# EasyEDA Pro project ProDoc_PCB1_2024-05-20.epro, board PCB1
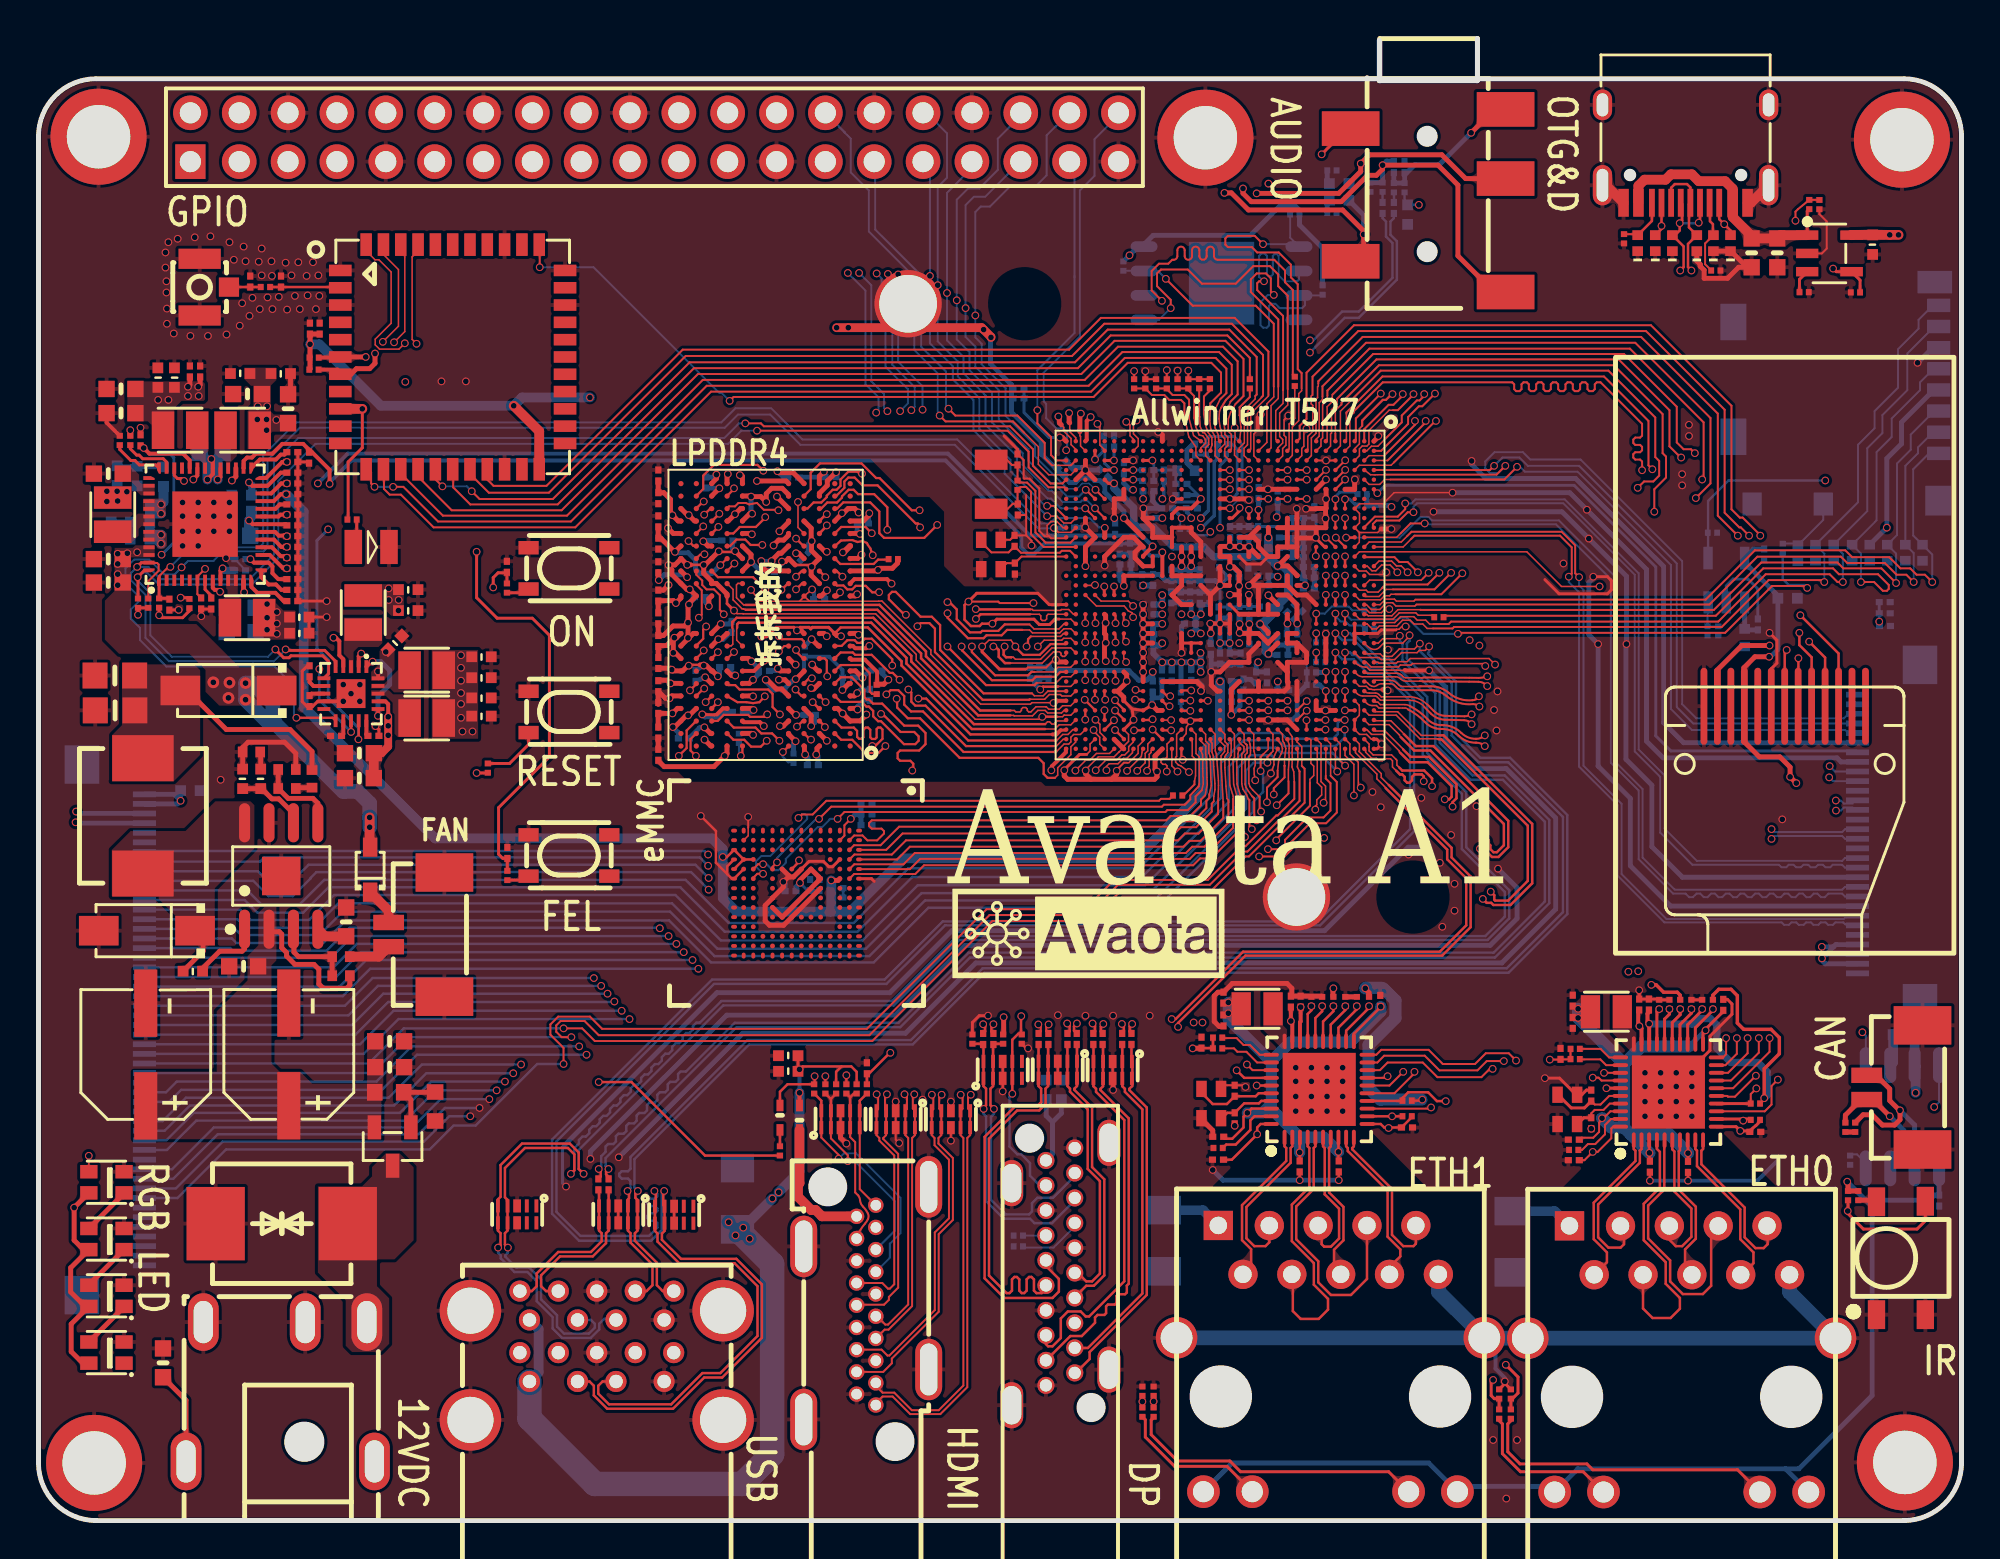
[diagram p0: board, top side]
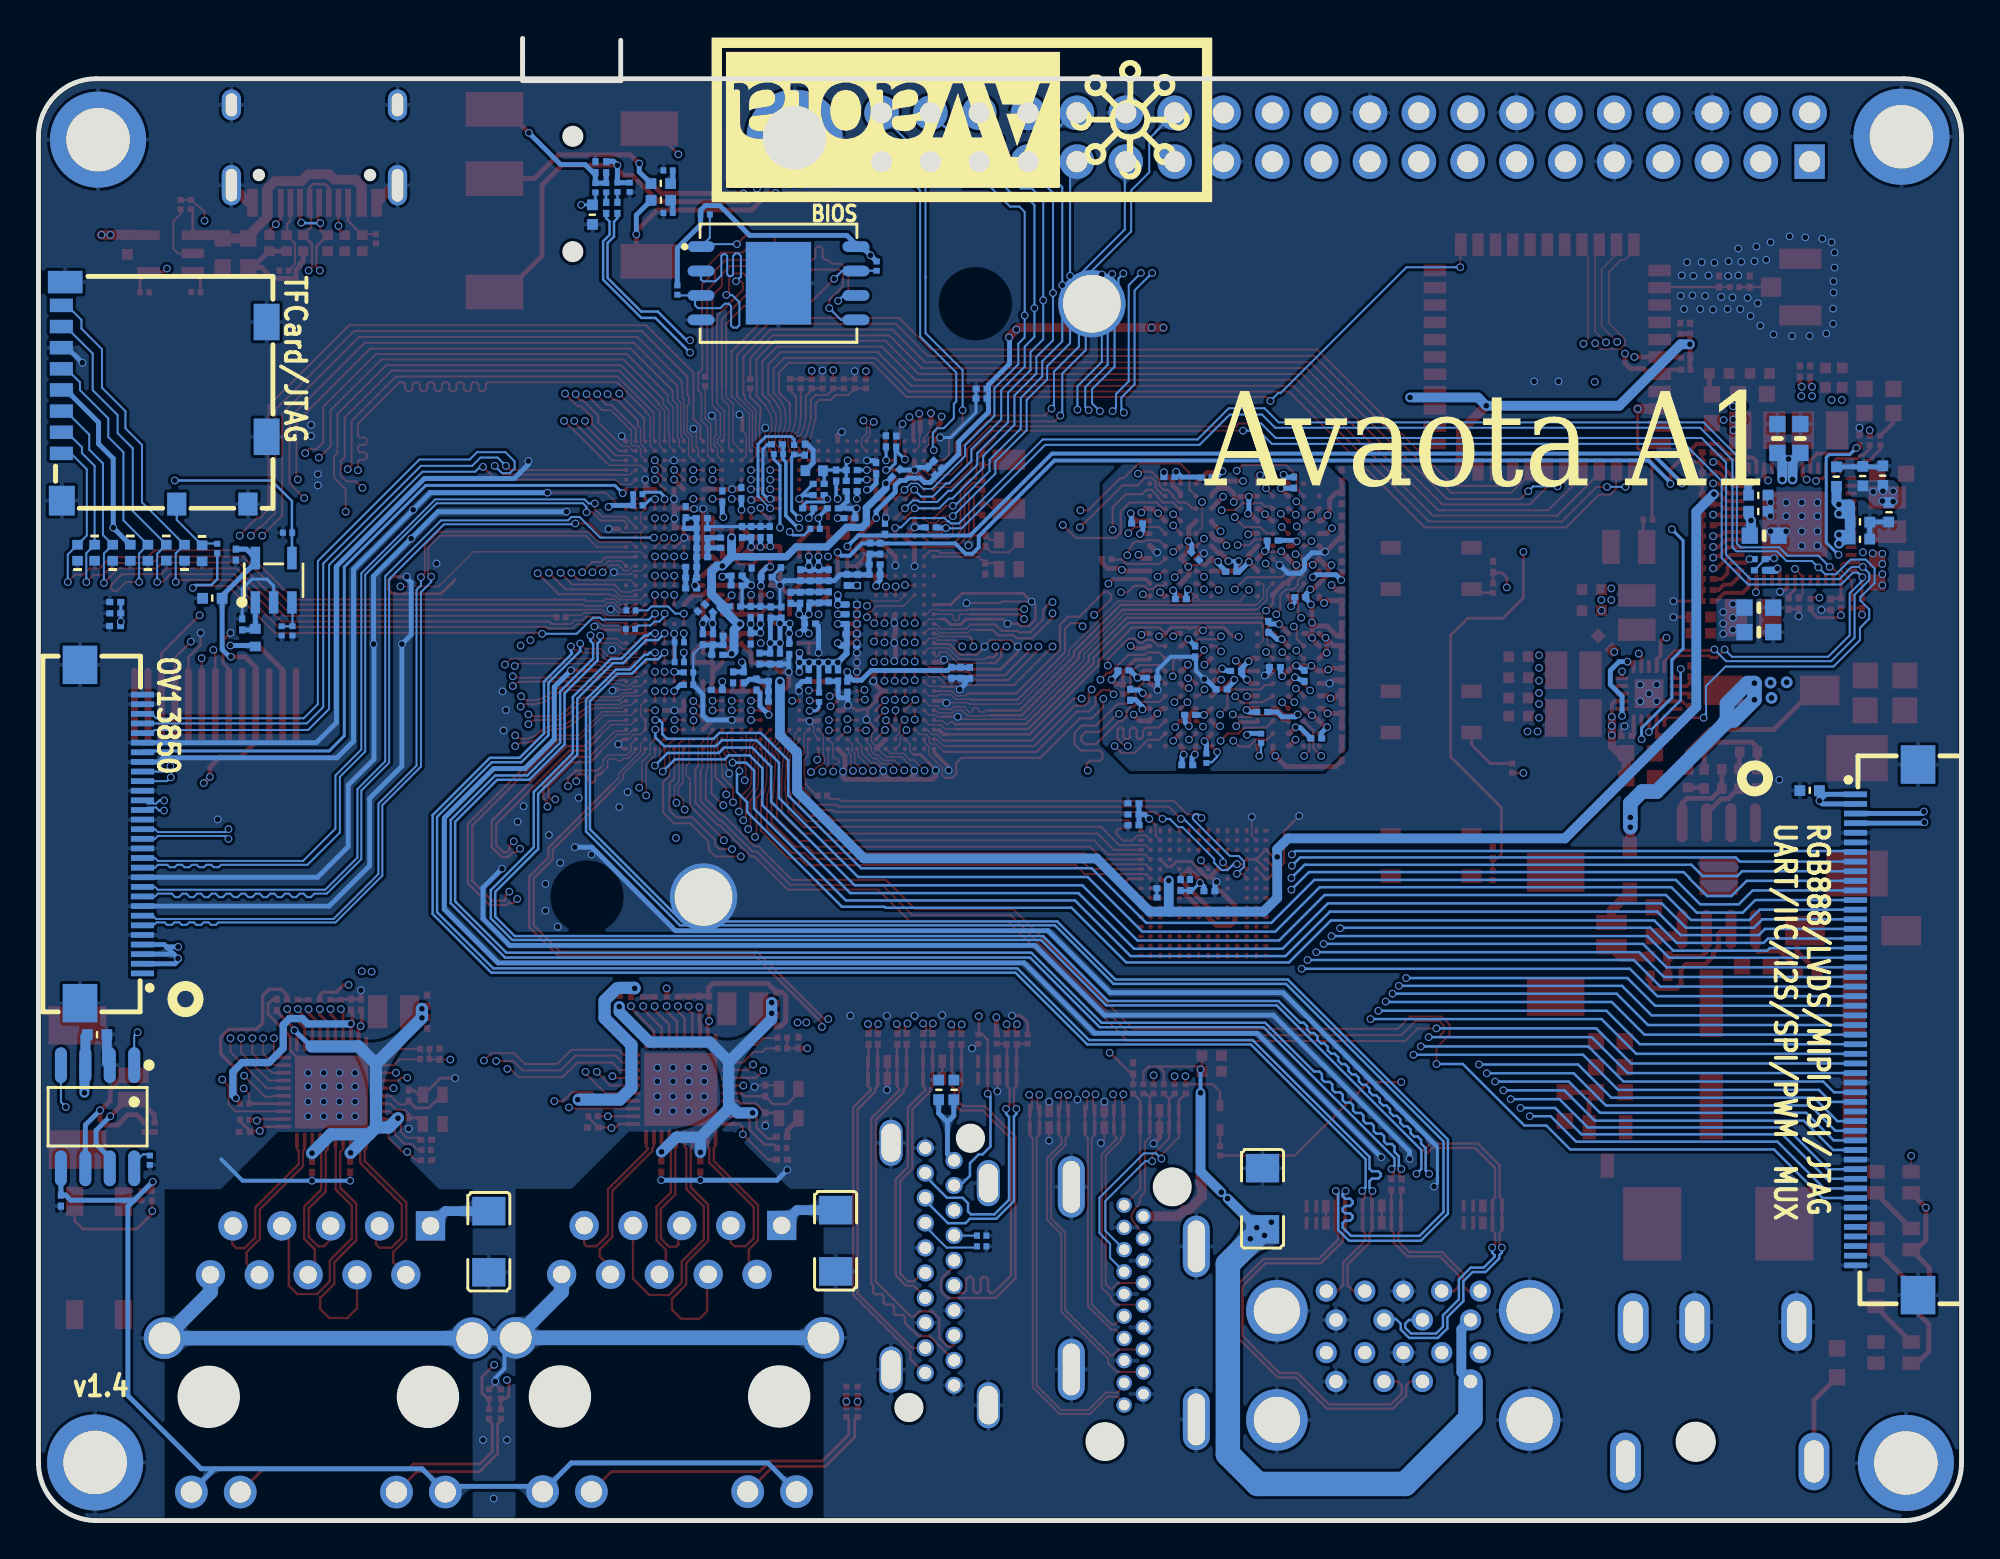
[diagram p1: board, bottom side, seen from below]

Outline 100 x 77.1 mm; copper layers: Top Layer, GND1, 内层2, VCC, 内层4, Inner5, GND2, Bottom Layer. Coordinates in mm from the lower left corner of the outline.
Outline path: 0,72 0,3 arc(0.88,0.88) 3,0 97,0 arc(99.12,0.88) 100,3 100,72 arc(99.12,74.12) 97,75 3,75 arc(0.88,74.12) 0,72
Stack: Top Layer 0.035mm 外层铜厚1oz / Dielectric1 0.1164mm 2116 RC54% 4.9mil / GND1 0.0152mm 内层铜厚 / Dielectric2 0.3mm 0.3mm H/HOZ 不含铜 / 内层2 0.0152mm 内层铜厚 / Dielectric3 0.0764mm 1080 RC67% 3.3mil / VCC 0.0152mm 内层铜厚 / Dielectric4 0.0764mm 1080 RC67% 3.3mil / 内层4 0.0152mm 内层铜厚 / Dielectric5 0.3mm 0.3mm H/HOZ 不含铜 / Inner5 0.0152mm 内层铜厚 / Dielectric6 0.0764mm 1080 RC67% 3.3mil / GND2 0.0152mm 内层铜厚 / Dielectric7 0.0764mm 1080 RC67% 3.3mil / Bottom Layer 0.035mm 外层铜厚1oz

## Design rules (mm)
net USB0-DP: DP31
net USB0-DM: DP31
net HTX0N: DP17
net HTXCN: DP18
net EDP-TX0P: DP24
net USB1-DM: DP8
net HTXCP: DP18
net HTX0P: DP17
net USB1-DP: DP8
net HTX2N: DP16
net HTX1N: DP15
net USB2-DM: DP5
net HTX1P: DP15
net HTX2P: DP16
net USB2-DP: DP5
net USB2-RXN: DP7
net USB2-RXP: DP7
net USB2-TXN: DP30
net USB2-TXP: DP30
net EDP-AUXN: DP28
net EDP-AUXP: DP28
net EDP-TX3N: DP25
net EDP-TX3P: DP25
net EDP-TX2N: DP26
net EDP-TX1N: DP27
net EDP-TX2P: DP26
net EDP-TX1P: DP27
net EDP-TX0N: DP24
net $6N5317: DP22
net $6N5519: DP21
net $6N5400: DP22
net $6N5561: DP21
net $6N5603: DP20
net $6N5687: DP19
net $6N5645: DP20
net $6N5729: DP19
net $6N6466: DP23
net $6N6451: DP23
net MICIN3P: DP29
net MICIN3N: DP29
net GM0_MDIP0: DP4
net GM0_MDIN0: DP4
net GM0_MDIP1: DP3
net GM0_MDIN1: DP3
net GM0_MDIP2: DP2
net GM0_MDIN2: DP2
net GM0_MDIP3: DP1
net GM0_MDIN3: DP1
net GM1_MDIP0: DP12
net GM1_MDIN0: DP12
net GM1_MDIP1: DP11
net GM1_MDIN1: DP11
net GM1_MDIP2: DP10
net GM1_MDIN2: DP10
net GM1_MDIP3: DP9
net GM1_MDIN3: DP9
net $6N19249: DP6
net $6N19248: DP6
net MCSI0-D0P: DP34
net MCSI0-D0N: DP34
net MCSI0-CKP: DP37
net MCSI0-D1P: DP35
net MCSI0-CKN: DP37
net MCSI0-D1N: DP35
net MCSI0-D2N: DP36
net MCSI0-D2P: DP36
net MCSI0-D3N: DP32
net MCSI0-D3P: DP32
template: 8L BGA
spacing safeClearance (default): track to track 0.076, other pairs 0.076 to 0.3
track width trackWidth (default): min 0.076, default 0.102, max 2.54
differential pair differentialPair (default): width min 0.076, default 0.254, max 2.54; gap min 0.076, default 0.102
via viaSize (default): diameter min 0.399, default 0.45, max 10; hole min 0.201, default 0.201, max 5.999
pour e6316 uses DRAMCopper
pour e6310 uses DRAMCopper
pour e6313 uses DRAMCopper
pour e6314 uses DRAMCopper
pour e6311 uses DRAMCopper
pour e19614 uses DRAMCopper
pour e16705 uses DRAMCopper
pour e26415 uses DRAMCopper
pour e258 uses DRAMCopper
pour e10559 uses DRAMCopper
pour e31695 uses DRAMCopper
pour e7555 uses TBCopper
pour e8913 uses TBCopper
pour e6312 uses DRAMCopper
pour e27896 uses TBCopper
pour e5680 uses TBCopper
pour e4340 uses TBCopper
pour e4860 uses TBCopper
pour e7035 uses TBCopper
pour e8075 uses TBCopper

## Placement (name value [footprint] x y rotation side)
C1  100nF  [C0603-NSK]  18.26 24.93 180 top
C2  100nF  [C0603-NSK]  18.26 23.59 180 top
C3  100nF  [C0603-NSK]  6.48 8.2 270 top
C4  100nF  [c0402-nsk]  8.03 28.58 180 top
C5  47uF  [C0805 NSK]  3.98 42.14 0 top
C6  47uF  [C0805 NSK]  3.97 43.96 0 top
C7  100nF  [C0603-NSK]  10.67 28.83 0 top
C8  100nF  [C0603-NSK]  16 31.14 270 top
C9  2200pF  [c0402-nsk]  11.56 38.58 90 top
C10  22pF  [c0402-nsk]  10.62 38.58 90 top
C11  100nF  [c0201 nsk]  8.46 47.7 270 top
C12  1uF  [c0201 nsk]  13.21 54.51 0 top
C13  2.2uF  [c0201 nsk]  56.23 50.55 270 bottom
C14  2.2uF  [c0201 nsk]  56.76 50.56 270 bottom
C15  22uF  [c0402-nsk]  13.56 46.16 180 top
C16  22uF  [c0402-nsk]  13.56 47 180 top
C17  1uF  [c0201 nsk]  13.21 51.77 0 top
C18  22uF  [c0402-nsk]  7.07 59.45 270 top
C19  2.2uF  [c0201 nsk]  61.37 47.24 90 bottom
C20  2.2uF  [c0201 nsk]  60.96 45.34 270 bottom
C21  2.2uF  [c0201 nsk]  62.51 44.83 270 bottom
C22  2.2uF  [c0201 nsk]  61.95 44.83 270 bottom
C23  2.2uF  [c0201 nsk]  61.44 44.83 270 bottom
C24  2.2uF  [c0201 nsk]  61.93 47.24 90 bottom
C25  22uF  [c0402-nsk]  6.21 59.45 270 top
C26  22uF  [c0402-nsk]  6.5 54.31 90 bottom
C27  22uF  [C0603-NSK]  3.63 48.79 0 top
C28  22uF  [C0603-NSK]  3.63 50.01 0 top
C29  22uF  [c0402-nsk]  5.28 51.94 180 bottom
C30  1uF  [c0201 nsk]  10.49 49.43 0 bottom
C31  22uF  [c0402-nsk]  12.6 59.66 180 top
C32  22uF  [c0402-nsk]  5.13 54.33 90 bottom
C33  22uF  [c0402-nsk]  10.49 59.66 0 top
C34  22uF  [c0402-nsk]  4.09 54.36 90 bottom
C35  2.2uF  [c0201 nsk]  14.07 55.3 90 top
C36  2.2uF  [c0201 nsk]  59.89 48.03 90 bottom
C37  2.2uF  [c0201 nsk]  59.4 48.03 90 bottom
C38  2.2uF  [c0201 nsk]  60.39 48.01 90 bottom
C39  2.2uF  [c0201 nsk]  60.89 48.01 90 bottom
C40  2.2uF  [c0201 nsk]  58.9 48.03 90 bottom
C41  2.2uF  [c0201 nsk]  59.87 46.66 180 bottom
C42  22uF  [c0402-nsk]  3.78 52.45 270 bottom
C43  1uF  [c0201 nsk]  8.99 47.69 270 top
C44  22uF  [C0603-NSK]  3.63 54.46 0 top
C45  2.2uF  [c0201 nsk]  5.31 56.19 270 top
C46  2.2uF  [c0201 nsk]  10.49 50.01 180 bottom
C47  2.2uF  [c0201 nsk]  62.13 49.07 180 bottom
C48  2.2uF  [c0201 nsk]  62.97 45.87 270 bottom
C49  2.2uF  [c0201 nsk]  62.97 47.27 90 bottom
C50  2.2uF  [c0201 nsk]  62.46 47.27 90 bottom
C51  2.2uF  [c0201 nsk]  13.21 47.83 0 top
C52  2.2uF  [c0201 nsk]  13.21 48.41 0 top
C53  2.2uF  [c0201 nsk]  13.21 49.53 0 top
C54  2.2uF  [c0201 nsk]  13.21 50.09 0 top
C55  2.2uF  [c0201 nsk]  13.21 48.97 0 top
C56  2.2uF  [c0402-nsk]  10.57 53.34 0 bottom
C57  2.2uF  [c0201 nsk]  66.07 49.05 0 bottom
C58  2.2uF  [c0201 nsk]  66.07 48.49 0 bottom
C59  2.2uF  [c0201 nsk]  13.21 50.65 0 top
C60  2.2uF  [c0201 nsk]  13.2 53.39 180 top
C61  2.2uF  [c0201 nsk]  13.21 51.21 0 top
C62  2.2uF  [c0201 nsk]  13.2 53.95 180 top
C63  2.2uF  [c0201 nsk]  13.21 52.32 0 top
C64  2.2uF  [c0201 nsk]  13.2 55.07 180 top
C65  2.2uF  [c0201 nsk]  13.21 52.86 0 top
C66  2.2uF  [c0201 nsk]  13.2 55.58 180 top
C67  2.2uF  [c0201 nsk]  66.07 49.61 0 bottom
C68  2.2uF  [c0201 nsk]  65.48 50.11 180 bottom
C69  2.2uF  [c0201 nsk]  17.42 40.82 0 top
C70  4.7uF  [c0402-nsk]  18.54 45.66 225 top
C71  2.2uF  [c0201 nsk]  15.47 40.82 180 top
C72  22uF  [c0402-nsk]  23.04 41.84 180 top
C73  2.2uF  [c0201 nsk]  14.1 44.18 90 top
C74  22uF  [c0402-nsk]  23.04 42.79 180 top
C75  2.2uF  [c0201 nsk]  63.42 51.43 90 bottom
C76  2.2uF  [c0201 nsk]  62.94 51.43 90 bottom
C77  2.2uF  [c0201 nsk]  61.97 51.43 90 bottom
C78  2.2uF  [c0201 nsk]  62.45 51.43 90 bottom
C79  4.7uF  [c0402-nsk]  5.28 51.05 0 bottom
C80  22uF  [c0402-nsk]  23.04 43.84 180 top
C81  22uF  [c0402-nsk]  23.04 44.93 180 top
C82  4.7uF  [c0402-nsk]  10.57 52.5 0 bottom
C83  2.2uF  [c0201 nsk]  59.39 49.17 270 bottom
C84  2.2uF  [c0201 nsk]  58.91 49.17 270 bottom
C85  2.2uF  [c0201 nsk]  59.87 49.17 270 bottom
C86  2.2uF  [c0201 nsk]  60.38 49.17 270 bottom
C87  22uF  [c0402-nsk]  19.23 47.34 180 top
C88  1uF  [c0201 nsk]  14.1 42.62 270 top
C89  22uF  [c0402-nsk]  19.23 48.42 180 top
C90  100nF  [c0201 nsk]  56.51 49.73 180 bottom
C91  100nF  [c0201 nsk]  62.66 43.49 270 bottom
C92  100nF  [c0201 nsk]  55.98 51.59 270 bottom
C93  100nF  [c0201 nsk]  56.51 49.2 180 bottom
C94  1nF  [c0201 nsk]  53.59 51.66 180 bottom
C95  1nF  [c0201 nsk]  6.81 47.65 90 top
C96  1nF  [c0201 nsk]  24.38 34.72 270 top
C97  1nF  [c0201 nsk]  24.36 49.61 270 top
C98  22pF  [c0201 nsk]  50.77 49.52 90 top
C99  22pF  [c0201 nsk]  50.76 50.96 270 top
C100  22pF  [c0201 nsk]  50.93 52.6 90 top
C101  22pF  [c0201 nsk]  50.91 55.19 270 top
C102  100nF  [c0201 nsk]  57.84 52.15 0 bottom
C103  2.2uF  [c0201 nsk]  57.71 53.54 180 bottom
C104  2.2uF  [c0201 nsk]  64.24 50.6 180 bottom
C105  2.2uF  [c0201 nsk]  55.93 56.13 270 bottom
C106  10nF  [c0201 nsk]  60.15 55.7 270 bottom
C107  1nF  [c0201 nsk]  61.59 55.98 180 bottom
C108  2.2uF  [c0201 nsk]  59.44 53.92 0 bottom
C109  470nF  [c0201 nsk]  57.7 54.08 180 bottom
C110  470nF  [c0201 nsk]  57.7 54.64 180 bottom
C111  470nF  [c0201 nsk]  58.52 54.36 270 bottom
C112  470nF  [c0201 nsk]  59.97 52.65 180 bottom
C113  2.2uF  [c0201 nsk]  58.7 52.65 0 bottom
C114  2.2uF  [c0201 nsk]  59.44 53.34 0 bottom
C115  2.2uF  [c0201 nsk]  55.4 56.12 270 bottom
C116  2.2uF  [c0201 nsk]  33.55 40.69 180 bottom
C117  2.2uF  [c0201 nsk]  34.16 43.94 90 bottom
C118  100nF  [c0201 nsk]  40.11 41.91 180 bottom
C119  100nF  [c0201 nsk]  58.93 43.97 90 bottom
C120  100nF  [c0201 nsk]  37.97 49.35 180 bottom
C121  100nF  [c0201 nsk]  40.6 47.93 0 bottom
C122  100nF  [c0201 nsk]  43.59 44.22 0 bottom
C123  100nF  [c0201 nsk]  43.23 42.95 270 bottom
C124  100nF  [c0201 nsk]  36.37 42.06 0 bottom
C125  100nF  [c0201 nsk]  41.2 54.28 0 bottom
C126  100nF  [c0201 nsk]  57.75 45.52 0 bottom
C127  100nF  [c0201 nsk]  57.73 46.1 0 bottom
C128  100nF  [c0201 nsk]  57.73 47.65 0 bottom
C129  100nF  [c0201 nsk]  59.94 43.99 90 bottom
C130  100nF  [c0201 nsk]  35.81 50.98 180 bottom
C131  100nF  [c0201 nsk]  32.23 41 90 top
C132  2.2uF  [c0201 nsk]  52.53 44.09 270 bottom
C133  100nF  [c0201 nsk]  57.94 43.38 90 bottom
C134  2.2uF  [c0201 nsk]  39.85 45.21 90 bottom
C135  100nF  [c0201 nsk]  38.48 43.23 0 bottom
C136  100nF  [c0201 nsk]  32.23 50.83 90 top
C137  100nF  [c0201 nsk]  35.71 44.4 0 bottom
C138  100nF  [c0201 nsk]  42.09 43.84 180 bottom
C139  100nF  [c0201 nsk]  32.23 51.97 270 top
C140  100nF  [c0201 nsk]  32.23 43.41 90 top
C141  100nF  [c0201 nsk]  39.85 50.17 225 bottom
C142  2.2uF  [c0201 nsk]  36.04 46.48 270 bottom
C143  2.2uF  [c0201 nsk]  34.72 54 90 bottom
C144  100nF  [c0201 nsk]  39.24 54.25 180 bottom
C145  100nF  [c0201 nsk]  42.88 51.87 0 bottom
C146  100nF  [c0201 nsk]  32.23 42.27 270 top
C147  2.2uF  [c0201 nsk]  32.23 44.6 270 top
C148  100nF  [c0201 nsk]  32.23 45.75 270 top
C149  100nF  [c0201 nsk]  32.23 46.94 90 top
C150  100nF  [c0201 nsk]  32.23 49.58 270 top
C151  100nF  [c0201 nsk]  37.72 44.2 180 bottom
C152  100nF  [c0201 nsk]  40.26 39.29 180 bottom
C153  100nF  [c0201 nsk]  57.73 46.63 0 bottom
C154  100nF  [c0201 nsk]  57.73 47.14 0 bottom
C155  100nF  [c0201 nsk]  58.42 43.97 90 bottom
C156  100nF  [c0201 nsk]  34.39 48.03 0 bottom
C157  100nF  [c0201 nsk]  32.23 39.83 270 top
C158  100nF  [c0201 nsk]  32.23 48.11 270 top
C159  100nF  [c0201 nsk]  32.23 53.19 90 top
C160  100nF  [c0201 nsk]  32.23 54.36 270 top
C161  2.2uF  [c0201 nsk]  52.04 44.09 270 bottom
C162  100nF  [c0201 nsk]  51.56 44.09 90 bottom
C163  2.2uF  [c0201 nsk]  61.75 43.13 180 bottom
C164  100nF  [c0201 nsk]  61.75 43.66 180 bottom
C165  2.2uF  [c0201 nsk]  63.45 53.44 270 bottom
C166  100nF  [c0201 nsk]  63.32 43.87 90 bottom
C167  2.2uF  [c0201 nsk]  65.13 47.45 225 bottom
C168  100nF  [c0201 nsk]  65.51 47.09 225 bottom
C169  2.2uF  [c0201 nsk]  64.72 43.21 180 bottom
C170  100nF  [c0201 nsk]  64.44 53.26 270 bottom
C171  2.2uF  [c0201 nsk]  63.88 43.87 90 bottom
C172  100nF  [c0201 nsk]  56.44 54.74 270 bottom
C173  2.2uF  [c0201 nsk]  63.7 49.15 0 bottom
C174  100nF  [c0201 nsk]  63.7 48.64 0 bottom
C175  2.2uF  [c0201 nsk]  64.92 45.85 90 bottom
C176  100nF  [c0201 nsk]  65.46 45.85 90 bottom
C177  2.2uF  [c0201 nsk]  57.96 48.92 270 bottom
C178  100nF  [c0201 nsk]  57.39 48.91 270 bottom
C179  2.2uF  [c0201 nsk]  14.62 62 270 top
C180  100nF  [c0201 nsk]  14.12 62 270 top
C181  2.2uF  [c0201 nsk]  53.22 54.92 225 bottom
C182  100nF  [c0201 nsk]  53.56 54.57 225 bottom
C183  2.2uF  [c0201 nsk]  50.96 58.37 180 bottom
C184  100nF  [c0201 nsk]  50.95 58.88 180 bottom
C185  2.2uF  [c0201 nsk]  64.11 45.54 180 bottom
C186  100nF  [c0201 nsk]  64.11 46.03 180 bottom
C187  2.2uF  [c0201 nsk]  63.78 47.55 0 bottom
C188  100nF  [c0201 nsk]  64.24 51.13 180 bottom
C189  100nF  [c0201 nsk]  43.08 23.52 270 top
C190  100nF  [c0201 nsk]  56.84 25.05 270 top
C191  100nF  [c0201 nsk]  56.35 25.05 270 top
C192  100nF  [c0201 nsk]  55.34 25.05 270 top
C193  100nF  [c0201 nsk]  54.85 25.05 270 top
C194  100nF  [c0201 nsk]  53.99 25.05 270 top
C195  100nF  [c0201 nsk]  53.51 25.05 270 top
C196  100nF  [c0201 nsk]  52.52 25.05 270 top
C197  100nF  [c0201 nsk]  52.01 25.05 270 top
C198  100nF  [c0201 nsk]  49.12 25.04 270 top
C199  100nF  [c0201 nsk]  49.66 25.04 270 top
C200  10uF  [c0402-nsk]  90.96 47.97 180 bottom
C201  2.2uF  [c0201 nsk]  64.69 45.03 180 bottom
C202  2.2uF  [c0201 nsk]  55.42 54.48 315 bottom
C204  2.2uF  [c0201 nsk]  98.83 16.65 90 bottom
C208  2.2uF  [c0201 nsk]  61.39 49.86 90 bottom
C209  100nF  [c0201 nsk]  62.92 49.84 90 bottom
C210  2.2uF  [c0201 nsk]  7.87 59.77 270 top
C211  100nF  [c0201 nsk]  65.51 51.61 0 bottom
C213  100nF  [c0201 nsk]  65.51 52.15 0 bottom
C214  2.2uF  [c0201 nsk]  66.34 52.45 270 bottom
C215  2.2uF  [c0201 nsk]  65.49 50.6 0 bottom
C216  100nF  [c0201 nsk]  65.49 51.11 0 bottom
C218  100nF  [c0201 nsk]  8.41 59.77 270 top
C219  100nF  [c0201 nsk]  29.65 17.48 270 top
C220  100nF  [c0201 nsk]  29.11 17.48 270 top
C221  2.2uF  [c0402-nsk]  38.99 24.18 0 top
C222  100nF  [c0402-nsk]  38.99 23.37 0 top
C223  2.2uF  [c0402-nsk]  53.19 22.41 270 bottom
C224  100nF  [c0402-nsk]  52.4 22.41 270 bottom
C225  2.2uF  [c0201 nsk]  41.55 32.41 0 bottom
C226  100nF  [c0201 nsk]  41.55 32.89 180 bottom
C227  100nF  [c0201 nsk]  61.75 42.6 180 bottom
C228  2.2uF  [c0201 nsk]  96.01 47.19 0 bottom
C229  100nF  [c0201 nsk]  40.13 33.05 270 bottom
C230  100nF  [c0201 nsk]  39.12 32.74 0 bottom
C231  2.2uF  [c0201 nsk]  43.07 37.31 0 bottom
C232  100nF  [c0201 nsk]  43.05 36.73 180 bottom
C233  100nF  [c0201 nsk]  43.05 36.17 180 bottom
C234  2.2uF  [c0201 nsk]  96.01 47.78 0 bottom
C235  100nF  [c0201 nsk]  40.61 33.05 270 bottom
C236  100nF  [c0201 nsk]  96.01 46.53 180 bottom
C237  2.2uF  [c0402-nsk]  71.19 67.93 90 bottom
C238  100nF  [c0201 nsk]  70.48 68.29 90 bottom
C239  33pF  [c0201 nsk]  70.48 70.4 270 bottom
C240  100nF  [c0201 nsk]  71.04 70.4 270 bottom
C241  100nF  [c0201 nsk]  69.89 68.29 90 bottom
C242  100nF  [c0402-nsk]  67.63 68.68 180 bottom
C243  100nF  [c0402-nsk]  67.64 69.55 180 bottom
C244  NC  [c0201 nsk]  12.61 64.45 270 top
C245  NC  [c0201 nsk]  11.01 64.45 270 top
C246  100nF  [c0402-nsk]  96.95 25.28 0 bottom
C247  2.2uF  [c0402-nsk]  7.9 37.97 180 bottom
C248  10nF/2KV  [C1206]  58.55 14.55 90 bottom
C249  2.2uF  [c0201 nsk]  65.63 27 90 top
C250  2.2uF  [c0201 nsk]  65.13 27 90 top
C251  22pF  [c0201 nsk]  62.2 20.93 90 top
C252  22pF  [c0201 nsk]  62.2 22.35 270 top
C253  2.2uF  [c0201 nsk]  61.62 26.01 270 top
C254  100nF  [c0201 nsk]  61.62 27.2 90 top
C255  10nF/2KV  [C1206]  76.58 14.5 90 bottom
C256  2.2uF  [c0201 nsk]  83.74 26.85 90 top
C257  22pF  [c0201 nsk]  80.75 20.68 90 top
C258  2.2uF  [c0201 nsk]  83.24 26.85 90 top
C259  22pF  [c0201 nsk]  80.75 22.1 270 top
C260  2.2uF  [c0201 nsk]  79.78 27.05 90 top
C261  100nF  [c0201 nsk]  79.78 25.88 270 top
C262  100nF  [c0201 nsk]  61.33 18.77 180 top
C263  100nF  [c0201 nsk]  60.48 24.87 90 top
C264  100nF  [c0201 nsk]  71.17 20.45 0 top
C265  100nF  [c0201 nsk]  61.34 19.96 180 top
C266  100nF  [c0201 nsk]  67.61 18.42 270 top
C267  100nF  [c0201 nsk]  65.58 18.42 270 top
C268  100nF  [c0201 nsk]  69.77 27.03 270 top
C269  100nF  [c0201 nsk]  79.83 18.75 180 top
C270  100nF  [c0201 nsk]  89.28 20.22 0 top
C271  100nF  [c0201 nsk]  79.15 24.28 90 top
C272  100nF  [c0201 nsk]  85.78 18.39 270 top
C273  100nF  [c0201 nsk]  79.83 19.81 180 top
C274  100nF  [c0201 nsk]  87.61 26.83 90 top
C275  100nF  [c0201 nsk]  83.79 18.42 90 top
C276  2.2uF  [c0201 nsk]  89.74 50.24 270 bottom
C277  2.2uF  [c0201 nsk]  89.41 46.61 270 bottom
C280  100nF  [c0402-nsk]  95.38 66.37 90 top
C281  22uF  [C0603-NSK]  90.42 65.94 90 top
C282  22uF  [C0603-NSK]  89.09 65.94 90 top
C283  22uF  [C0603-NSK]  16.69 38.62 0 top
C284  22uF  [C0603-NSK]  16.69 39.92 0 top
C285  22uF  [C0603-NSK]  9.58 56.29 270 bottom
C286  22uF  [C0603-NSK]  8.38 56.29 270 bottom
C287  22uF  [C0603-NSK]  10.26 51.23 0 bottom
C288  22uF  [C0603-NSK]  10.54 47.49 0 bottom
C289  22uF  [C0603-NSK]  10.54 46.22 0 bottom
C290  22uF  [C0603-NSK]  4.29 58.86 0 top
C291  22uF  [C0603-NSK]  4.29 57.61 0 top
C292  22uF  [C0603-NSK]  10.87 58.6 0 top
C293  22uF  [C0603-NSK]  12.98 57.84 270 top
C294  22uF  [C1206]  36.35 16.74 270 bottom
CGQ1  IRM-H638T/TR2  [SENSOR-SMD_IRM-H638T-TR2-TL]  96.85 13.66 90 top
CN2  PJ-327A0-SMT  [AUDIO-SMD_PJ-327A0-SMT]  72.26 68.66 270 top
CN3  0533980271  [CONN-SMD_2P-P1.25_053398-0X71]  96.52 22.53 90 top
CN4  0533980271  [CONN-SMD_2P-P1.25_053398-0X71]  19.66 30.48 90 top
D1  B5819WS  [SOD-323_L1.8-W1.3-LS2.5-RD]  17.25 33.86 90 top
D2  SMCJ15CA  [SMC_L6.9-W5.9-LS7.9-BI]  12.65 15.44 0 top
D3  SS54  [SMA_L4.4-W2.8-LS5.4-R-RD]  9.88 43.18 180 top
D4  SS54  [SMA_L4.4-W2.8-LS5.4-R-RD]  5.64 30.68 180 top
D5  RClamp0524PATCT  [SLP2510P8_L2.5-W1.0-P0.50-BL]  47.45 20.88 180 top
D6  RClamp0524PATCT  [SLP2510P8_L2.5-W1.0-P0.50-BL]  44.58 20.88 180 top
D7  B5819WT  [SOD-523_L1.2-W0.8-LS1.6-RD-1 NSK]  38.56 20.96 270 top
D8  RClamp0524PATCT  [SLP2510P8_L2.5-W1.0-P0.50-BL]  41.71 20.88 0 top
D9  B5819WT  [SOD-523_L1.2-W0.8-LS1.6-RD-1 NSK]  39.57 20.96 90 top
D10  RClamp0524PATCT  [SLP2510P8_L2.5-W1.0-P0.50-BL]  55.86 23.44 180 top
D11  RClamp0524PATCT  [SLP2510P8_L2.5-W1.0-P0.50-BL]  53 23.45 180 top
D12  RClamp0524PATCT  [SLP2510P8_L2.5-W1.0-P0.50-BL]  50.14 23.44 0 top
D13  RClamp0524PATCT  [SLP2510P8_L2.5-W1.0-P0.50-BL]  33.06 15.91 180 top
D14  RClamp0524PATCT  [SLP2510P8_L2.5-W1.0-P0.50-BL]  24.89 15.93 180 top
D15  RClamp0524PATCT  [SLP2510P8_L2.5-W1.0-P0.50-BL]  30.15 15.93 180 top
D16  0402ESDA-05N  [D0402]  91.49 50.32 270 bottom
D17  0402ESDA-05N  [D0402]  92.41 50.34 90 bottom
D18  0402ESDA-05N  [D0402]  93.35 50.35 270 bottom
D19  0402ESDA-05N  [D0402]  94.31 50.34 90 bottom
D20  0402ESDA-05N  [D0402]  95.22 50.34 270 bottom
D21  0402ESDA-05N  [D0402]  96.14 50.34 90 bottom
D22  0402ESDA-05N  [D0402]  97.08 50.34 270 bottom
D23  0402ESDA-05N  [D0402]  97.97 50.34 90 bottom
D24  0402ESDA-05N  [d0402]  87.1 66.45 90 top
D25  0402ESDA-05N  [d0402]  86.23 66.45 90 top
D26  0402ESDA-05N  [d0402]  84.96 66.45 90 top
D27  0402ESDA-05N  [d0402]  84.07 66.45 90 top
D30  0402ESDA-05N  [d0402]  87.99 66.45 90 top
D31  0402ESDA-05N  [d0402]  83.16 66.45 90 top
DC1  DC-044A-A200  [DC-IN-TH_DC-044A-20A]  12.57 6.7 90 top
FAN  -  [FAN2510]  48.36 60.76 270 top
FEL1  YTSA016A0252501B  [SW-SMD_4P-L4.2-W3.4-P2.15-LS4.5-TL]  27.58 34.6 0 top
FPC1  FPC-05FB-50PH20  [FPC-SMD_50P-P0.50_FPC-05FB-50PH20]  3.89 25.53 90 bottom
FPC2  FPC-05FB-30PH20  [FPC-SMD_30P-P0.50_FPC-05FB-30PH20]  96.22 35.71 270 bottom
H1  12251220ANG0S115001  [HDR-TH_40P-P2.54-V-M-R2-C20-S2.54]  32.03 71.96 0 top
L1  4.7uH  [IND-SMD_L7.0-W6.6]  5.43 36.66 90 top
L2  1uH  [ind-smd_l2.0-w1.6_1]  10.85 46.96 180 top
L3  1uH  [ind-smd_l2.0-w1.6_1]  7.37 56.72 0 top
L4  1uH  [ind-smd_l2.0-w1.6_1]  10.62 56.72 180 top
L5  1uH  [ind-smd_l2.0-w1.6_1]  3.86 52.32 90 top
L6  1uH  [ind-smd_l2.0-w1.6_1]  20.19 41.74 180 top
L7  1uH  [ind-smd_l2.0-w1.6_1]  20.19 44.23 180 top
L8  1uH  [ind-smd_l2.0-w1.6_1]  16.89 47.23 270 top
L9  2.2uH  [IND-SMD_L2.0-W1.6]  63.37 26.62 0 top
L10  2.2uH  [IND-SMD_L2.0-W1.6]  81.53 26.47 0 top
LED1  -  [RGBLED_0807]  17.29 50.64 0 top
LED2  WS2812B-2020  [LED-SMD_4P-L2.0-W2.0-TL_WS2812B-2020]  3.54 17.6 180 top
LED3  WS2812B-2020  [LED-SMD_4P-L2.0-W2.0-TL_WS2812B-2020]  3.54 14.64 180 top
LED4  WS2812B-2020  [LED-SMD_4P-L2.0-W2.0-TL_WS2812B-2020]  3.54 11.69 180 top
LED5  WS2812B-2020  [LED-SMD_4P-L2.0-W2.0-TL_WS2812B-2020]  3.54 8.74 180 top
NOREF  -  [Pad_e553]  3.12 71.98 0 top
NOREF#2  -  [Pad_e551]  2.9 3 0 top
NOREF#3  -  [Pad_e555]  97.05 3.02 0 top
NOREF#4  -  [Pad_e563]  60.68 71.93 0 top
NOREF#5  -  [Pad_e554]  96.9 71.83 0 top
PWR1  YTSA016A0252501B  [SW-SMD_4P-L4.2-W3.4-P2.15-LS4.5-TL]  27.58 49.53 0 top
Q1  YJL2305A  [SOT-23-3_L2.9-W1.3-P1.90-LS2.4-BR]  18.41 19.46 90 top
R1  100K  [R0603 NSK]  18.24 22.28 180 top
R2  100K  [R0603 NSK]  20.62 21.54 90 top
R3  51.1  [R0402-NSK]  14.22 38.58 90 top
R4  665K  [R0402-NSK]  15.73 28.34 0 top
R5  10.2K  [R0402-NSK]  12.92 38.08 0 top
R6  130K  [R0402-NSK]  15.73 29.33 180 top
R7  37.4K  [R0402-NSK]  11.07 39.98 180 top
R8  1.96K  [R0402-NSK]  12.92 39.07 180 top
R9  10K  [r0201 nsk]  6.27 47.73 90 top
R10  10K  [r0201 nsk]  7.85 47.7 90 top
R11  4K7  [r0201 nsk]  5.18 47.72 90 top
R12  4K7  [r0201 nsk]  5.71 47.72 90 top
R13  10K  [r0201 nsk]  4.23 56.19 270 top
R14  0  [r0201 nsk]  4.78 56.19 270 top
R17  5K1  [r0201 nsk]  16.31 52.07 180 top
R19  10K  [r0201 nsk]  60.36 59.14 90 top
R20  10K  [r0201 nsk]  60.92 59.14 90 top
R21  1K  [r0201 nsk]  23.37 39.14 270 top
R22  1K  [r0201 nsk]  24.38 33.55 90 top
R23  1K  [r0201 nsk]  24.36 48.51 90 top
R24  0  [r0201 nsk]  59.61 51.59 0 bottom
R25  10M  [r0201 nsk]  50.91 53.86 90 top
R26  1K  [r0201 nsk]  60.71 55.7 270 bottom
R27  1K  [r0201 nsk]  61.52 55.47 180 bottom
R28  0  [R0402-NSK]  59.66 54.61 180 bottom
R30  10K  [r0201 nsk]  58.67 59.13 90 top
R31  NC  [r0201 nsk]  59.79 59.13 90 top
R32  10K  [r0201 nsk]  56.97 59.13 90 top
R33  3.9K  [r0201 nsk]  58.12 59.13 270 top
R34  10K  [r0201 nsk]  59.23 59.13 270 top
R35  NC  [r0201 nsk]  57.56 59.13 270 top
R36  0  [r0201 nsk]  43.59 43.23 90 top
R37  0  [r0201 nsk]  44.45 50.01 0 top
R38  120  [r0201 nsk]  59.41 42.82 90 bottom
R39  240  [r0201 nsk]  39.27 39.65 90 bottom
R40  240  [r0201 nsk]  36.42 40.69 90 bottom
R41  33  [r0201 nsk]  59.24 37.72 0 top
R42  33  [r0201 nsk]  72.82 46.99 0 top
R43  33  [r0201 nsk]  62.99 59.13 90 top
R44  200  [r0201 nsk]  66.67 45.68 180 bottom
R45  200  [r0201 nsk]  69.19 47.35 0 bottom
R46  200  [r0201 nsk]  66.67 44.65 180 bottom
R47  10K  [r0201 nsk]  38.56 19.23 90 top
R48  100  [r0201 nsk]  40.34 22.45 270 top
R49  1K  [r0201 nsk]  69.22 46.38 180 bottom
R50  100  [r0201 nsk]  40.92 22.45 270 top
R51  100  [r0201 nsk]  42.01 22.45 270 top
R52  4K7  [r0201 nsk]  41.48 22.45 270 top
R53  4K7  [r0201 nsk]  42.54 22.45 270 top
R54  1K  [r0201 nsk]  43.08 22.45 270 top
R55  1K  [r0201 nsk]  66.19 43.47 0 bottom
R56  1M  [r0201 nsk]  50.95 14.26 0 bottom
R57  1M  [r0201 nsk]  50.95 14.82 0 bottom
R59  1K  [r0201 nsk]  66.19 44.12 0 bottom
R60  10K  [r0201 nsk]  51.13 25.04 90 top
R61  100K  [r0201 nsk]  50.16 25.04 270 top
R62  100K  [r0201 nsk]  48.56 25.04 270 top
R63  10K  [r0201 nsk]  90.7 50.57 90 bottom
R64  2K  [r0201 nsk]  71.04 69.33 270 bottom
R65  10K  [r0201 nsk]  70.48 69.33 90 bottom
R66  10K  [r0201 nsk]  69.89 69.35 90 bottom
R67  22  [r0201 nsk]  67.26 68.02 180 bottom
R68  22  [r0201 nsk]  67.26 70.23 180 bottom
R69  10K  [r0201 nsk]  14.33 60.5 0 top
R70  10K  [r0201 nsk]  14.33 59.87 0 top
R72  0  [r0201 nsk]  11.8 64.17 180 top
R73  10K  [r0201 nsk]  65.33 67.95 0 bottom
R74  10K  [r0201 nsk]  66.78 64.01 90 bottom
R75  10K  [r0201 nsk]  56.41 65.25 90 bottom
R76  10K  [r0201 nsk]  94.21 18.75 270 bottom
R77  60  [r0201 nsk]  93.96 20.45 90 top
R78  60  [r0201 nsk]  94.47 20.46 90 top
R79  510  [r0201 nsk]  57.4 5.64 270 top
R80  510  [r0201 nsk]  57.99 5.64 90 top
R82  4.7K  [r0201 nsk]  68.55 27 270 top
R83  1.5K  [r0201 nsk]  71.17 21.84 180 top
R85  2.49K  [r0201 nsk]  61.34 19.38 0 top
R86  4.7K  [r0201 nsk]  67.96 27 270 top
R88  4.7K  [r0201 nsk]  61.32 25.12 0 top
R89  4.7K  [r0201 nsk]  67.34 27 90 top
R90  4.7K  [r0201 nsk]  71.17 21.03 180 top
R91  4.7K  [r0201 nsk]  69.19 27 90 top
R92  4.7K  [r0201 nsk]  61.32 24.56 180 top
R93  4.7K  [r0201 nsk]  66.19 27 270 top
R94  4.7K  [r0201 nsk]  57.99 6.73 270 top
R95  4.7K  [r0201 nsk]  66.75 27 270 top
R96  4.7K  [r0201 nsk]  57.4 6.73 270 top
R97  510  [r0201 nsk]  75.96 5.54 270 top
R98  510  [r0201 nsk]  76.56 5.54 90 top
R100  4.7K  [r0201 nsk]  86.51 26.85 270 top
R101  1.5K  [r0201 nsk]  89.28 21.69 180 top
R103  2.49K  [r0201 nsk]  79.83 19.28 0 top
R104  4.7K  [r0201 nsk]  85.95 26.85 270 top
R106  4.7K  [r0201 nsk]  79.91 24.54 0 top
R107  4.7K  [r0201 nsk]  85.37 26.85 90 top
R108  4.7K  [r0201 nsk]  89.28 20.84 180 top
R109  4.7K  [r0201 nsk]  87.07 26.85 90 top
R110  4.7K  [r0201 nsk]  79.91 24 180 top
R111  4.7K  [r0201 nsk]  84.28 26.85 270 top
R112  4.7K  [r0201 nsk]  76.56 6.58 270 top
R113  4.7K  [r0201 nsk]  84.81 26.85 270 top
R114  4.7K  [r0201 nsk]  75.96 6.58 270 top
R115  6K8  [r0201 nsk]  87.35 46.28 90 bottom
R116  6K8  [r0201 nsk]  86.79 46.28 270 bottom
R117  6K8  [r0201 nsk]  91.82 63.9 0 top
R118  100K  [r0201 nsk]  94.48 63.89 0 top
R119  100K  [r0201 nsk]  87.05 51.38 180 bottom
R120  180K  [r0201 nsk]  92.08 68.46 270 top
R121  100K  [r0201 nsk]  92.61 68.45 90 top
R122  0  [r0201 nsk]  69.26 69.35 90 bottom
R123  33  [r0201 nsk]  65.33 59.26 270 top
R124  10k  [r0201 nsk]  94.1 16.9 90 top
R125  33  [r0201 nsk]  94.63 16.9 90 top
R126  1K  [R0402-NSK]  88.72 45.92 90 bottom
R127  4.7K  [r0201 nsk]  68.83 53.39 180 bottom
R128  4.7K  [r0201 nsk]  68.83 52.81 180 bottom
R129  5.1K  [r0201 nsk]  82.45 66.68 90 top
R130  5.1K  [r0201 nsk]  87.22 65.02 180 top
RESET1  YTSA016A0252501B  [SW-SMD_4P-L4.2-W3.4-P2.15-LS4.5-TL]  27.58 42.06 0 top
RF1  BWIPX-1-001E  [IPEX-SMD_BWIPX-1-001E]  9.14 64.16 180 top
RJ1  -  [RJ45-TH_HR911130A]  67.18 8.43 180 top
RJ2  -  [RJ45-TH_HR911130A]  85.45 8.41 180 top
SIM1  1040310811  [SIM-SMD_8P-1040310811]  93.47 58.65 270 bottom
TFT1  -  [TFT_1.14寸_0.7MM-13P]  90.81 45.01 270 top
U1  100uF  [CAP-SMD_BD6.3-L6.6-W6.6-LS7.6-RD]  5.58 24.24 90 top
U2  100uF  [CAP-SMD_BD6.3-L6.6-W6.6-LS7.6-RD]  13.02 24.25 90 top
U3  TPS54531DDAR  [SOIC-8_L5.0-W4.0-P1.27-LS6.0-BL-EP2.0]  12.62 33.53 0 top
U4  AXP717  [QFN-52_L6.0-W6.0-P0.40-BL-EP3.4-1]  8.66 51.83 0 top
U5  AXP323  [QFN-20_L3.0-W3.0-P0.40-BL-EP1.5]  16.25 43.01 180 top
U8  -  [FBGA-153_L13.0-W11.5]  39.42 32.64 270 top
U9  AIC8800D  [LGA-44_L12.0-W12.0-P0.90]  21.54 60.53 0 top
U11  TJA1051T  [SOP-8_L4.9-W3.9-P1.27-LS6.0-BL]  96.93 21.01 0 bottom
U12  RTL8211F-CG  [WQFN-40_L5.0-W5.0-P0.4-BL-EP]  66.6 22.43 0 top
U13  RTL8211F-CG  [WQFN-40_L5.0-W5.0-P0.4-BL-EP]  84.76 22.29 0 top
U14  T527  [T527-BGA664]  61.44 48.15 270 top
U15  -  [DP_TH_SIDE_VERTICAL]  53.11 8.56 180 top
U16  SY6280AAC  [SOT-23-5_L3.0-W1.7-P0.95-LS2.8-BL]  87.77 48.91 180 bottom
U17  SY6280AAC  [SOT-23-5_L3.0-W1.7-P0.95-LS2.8-BL]  93.13 65.91 270 top
U18  W25N01GVZEIG  [WSON-8_L8.0-W6.10-P1.27-BL-EP]  61.52 64.36 270 bottom
UD1  LPDDR4_FBGA200  [BGA200P65_80B1000_1500H90]  37.81 47.11 180 top
USB1  HDMI-001C  [HDMI-SMD_HDMI-001C]  43.04 11.31 270 top
USB2  USB-303WSD-BRY  [USB-A-TH_XUNPU_USB-303WSD-BRY]  29.03 8.59 0 top
USB3  -  [USB-C-SMD_TYPEC-304-BCP16-1]  85.65 71.09 180 top
X1  24MHz  [crystal-smd_4p-l2.0-w1.6-bl-nsk]  49.53 50.25 270 top
X2  32.768kHz  [osc-smd_l3.2-w1.5 nsk]  49.54 53.91 90 top
X3  25MHz  [crystal-smd_4p-l2.0-w1.6-bl-nsk]  60.99 21.69 270 top
X4  25MHz  [crystal-smd_4p-l2.0-w1.6-bl-nsk]  79.5 21.39 270 top

## Footprints (pads in the part's own frame, mm; a bottom-side part is the same pattern mirrored in y, then rotated)
AUDIO-SMD_PJ-327A0-SMT
  rect 1.8x3 smd: 2(3.15,-4.028) 3(-3.75,-4.028) 4(-4.75,4.028) 5(-1.15,4.028) 6(4.75,4.028)
BGA200P65_80B1000_1500H90
  round 0.27 smd: A1(-4.4,6.825) A2(-3.6,6.825) A3(-2.8,6.825) A4(-2,6.825) A5(-1.2,6.825) A8(1.2,6.825) A9(2,6.825) A10(2.8,6.825) A11(3.6,6.825) A12(4.4,6.825) AA1(-4.4,-6.175) AA2(-3.6,-6.175) AA3(-2.8,-6.175) AA4(-2,-6.175) AA5(-1.2,-6.175) AA8(1.2,-6.175) AA9(2,-6.175) AA10(2.8,-6.175) AA11(3.6,-6.175) AA12(4.4,-6.175) AB1(-4.4,-6.825) AB2(-3.6,-6.825) AB3(-2.8,-6.825) AB4(-2,-6.825) AB5(-1.2,-6.825) AB8(1.2,-6.825) AB9(2,-6.825) AB10(2.8,-6.825) AB11(3.6,-6.825) AB12(4.4,-6.825) B1(-4.4,6.175) B2(-3.6,6.175) B3(-2.8,6.175) B4(-2,6.175) B5(-1.2,6.175) B8(1.2,6.175) B9(2,6.175) B10(2.8,6.175) B11(3.6,6.175) B12(4.4,6.175) C1(-4.4,5.525) C2(-3.6,5.525) C3(-2.8,5.525) C4(-2,5.525) C5(-1.2,5.525) C8(1.2,5.525) C9(2,5.525) C10(2.8,5.525) C11(3.6,5.525) C12(4.4,5.525) D1(-4.4,4.875) D2(-3.6,4.875) D3(-2.8,4.875) D4(-2,4.875) D5(-1.2,4.875) D8(1.2,4.875) D9(2,4.875) D10(2.8,4.875) D11(3.6,4.875) D12(4.4,4.875) E1(-4.4,4.225) E2(-3.6,4.225) E3(-2.8,4.225) E4(-2,4.225) E5(-1.2,4.225) E8(1.2,4.225) E9(2,4.225) E10(2.8,4.225) E11(3.6,4.225) E12(4.4,4.225) F1(-4.4,3.575) F2(-3.6,3.575) F3(-2.8,3.575) F4(-2,3.575) F5(-1.2,3.575) F8(1.2,3.575) F9(2,3.575) F10(2.8,3.575) F11(3.6,3.575) F12(4.4,3.575) G1(-4.4,2.925) G2(-3.6,2.925) G3(-2.8,2.925) G4(-2,2.925) G5(-1.2,2.925) G8(1.2,2.925) G9(2,2.925) G10(2.8,2.925) G11(3.6,2.925) G12(4.4,2.925) H1(-4.4,2.275) H2(-3.6,2.275) H3(-2.8,2.275) H4(-2,2.275) H5(-1.2,2.275) H8(1.2,2.275) H9(2,2.275) H10(2.8,2.275) H11(3.6,2.275) H12(4.4,2.275) J1(-4.4,1.625) J2(-3.6,1.625) J3(-2.8,1.625) J4(-2,1.625) J5(-1.2,1.625) J8(1.2,1.625) J9(2,1.625) J10(2.8,1.625) J11(3.6,1.625) J12(4.4,1.625) K1(-4.4,0.975) K2(-3.6,0.975) K3(-2.8,0.975) K4(-2,0.975) K5(-1.2,0.975) K8(1.2,0.975) K9(2,0.975) K10(2.8,0.975) K11(3.6,0.975) K12(4.4,0.975) N1(-4.4,-0.975) N2(-3.6,-0.975) N3(-2.8,-0.975) N4(-2,-0.975) N5(-1.2,-0.975) N8(1.2,-0.975) N9(2,-0.975) N10(2.8,-0.975) N11(3.6,-0.975) N12(4.4,-0.975) P1(-4.4,-1.625) P2(-3.6,-1.625) P3(-2.8,-1.625) P4(-2,-1.625) P5(-1.2,-1.625) P8(1.2,-1.625) P9(2,-1.625) P10(2.8,-1.625) P11(3.6,-1.625) P12(4.4,-1.625) R1(-4.4,-2.275) R2(-3.6,-2.275) R3(-2.8,-2.275) R4(-2,-2.275) R5(-1.2,-2.275) R8(1.2,-2.275) R9(2,-2.275) R10(2.8,-2.275) R11(3.6,-2.275) R12(4.4,-2.275) T1(-4.4,-2.925) T2(-3.6,-2.925) T3(-2.8,-2.925) T4(-2,-2.925) T5(-1.2,-2.925) T8(1.2,-2.925) T9(2,-2.925) T10(2.8,-2.925) T11(3.6,-2.925) T12(4.4,-2.925) U1(-4.4,-3.575) U2(-3.6,-3.575) U3(-2.8,-3.575) U4(-2,-3.575) U5(-1.2,-3.575) U8(1.2,-3.575) U9(2,-3.575) U10(2.8,-3.575) U11(3.6,-3.575) U12(4.4,-3.575) V1(-4.4,-4.225) V2(-3.6,-4.225) V3(-2.8,-4.225) V4(-2,-4.225) V5(-1.2,-4.225) V8(1.2,-4.225) V9(2,-4.225) V10(2.8,-4.225) V11(3.6,-4.225) V12(4.4,-4.225) W1(-4.4,-4.875) W2(-3.6,-4.875) W3(-2.8,-4.875) W4(-2,-4.875) W5(-1.2,-4.875) W8(1.2,-4.875) W9(2,-4.875) W10(2.8,-4.875) W11(3.6,-4.875) W12(4.4,-4.875) Y1(-4.4,-5.525) Y2(-3.6,-5.525) Y3(-2.8,-5.525) Y4(-2,-5.525) Y5(-1.2,-5.525) Y8(1.2,-5.525) Y9(2,-5.525) Y10(2.8,-5.525) Y11(3.6,-5.525) Y12(4.4,-5.525)
c0201 nsk
  rect 0.368x0.324 smd: 1(-0.292,0) 2(0.28,0)
c0402-nsk
  rect 0.559x0.559 smd: 1(-0.508,0) 2(0.508,0)
C0603-NSK
  rect 0.85x0.85 smd: 1(-0.75,0) 2(0.75,0)
C0805 NSK
  rect 1.3x1.35 smd: 1(-1.03,0) 2(1.03,0)
C1206
  rect 1.485x1.728 smd: 1(-1.593,0) 2(1.593,0)
CAP-SMD_BD6.3-L6.6-W6.6-LS7.6-RD
  rect 3.5x1.2 smd: 1(-2.67,0) 2(2.67,0)
CONN-SMD_2P-P1.25_053398-0X71
  rect 0.8x1.6 smd: 1(-0.63,1.45) 2(0.63,1.45)
  rect 2x3 smd: 3(3.229,-1.45) 4(-3.229,-1.45)
crystal-smd_4p-l2.0-w1.6-bl-nsk
  rect 0.846x0.546 smd: 1(-0.762,-0.508) 2(0.762,-0.508) 3(0.762,0.508) 4(-0.762,0.508)
d0402
  rect 0.505x0.551 smd: 1(-0.416,0) 2(0.416,0)
D0402
  rect 0.505x0.551 smd: 1(-0.416,0) 2(0.416,0)
DC-IN-TH_DC-044A-20A
  oval 3x1.6 hole 2.2x1: 1(3.625,-4.5) 2(3.625,4.001) 3(3.625,-1.3) 4(-3.625,-4.9) 5(-3.625,4.9)
DP_TH_SIDE_VERTICAL
  round 0.889 hole 0.635: 1(-0.774,0.879) 2(0.724,1.529) 3(-0.774,-0.421) 4(0.724,0.229) 5(-0.774,-1.72) 6(0.724,-1.072) 7(-0.774,-3.02) 8(0.724,-2.37) 9(-0.774,-4.321) 10(0.724,-3.671) 11(-0.774,-5.621) 12(0.724,-4.971) 13(-0.774,-6.921) 14(0.724,-6.271) 15(-0.774,-8.222) 16(0.724,-7.572) 17(-0.774,-9.52) 18(0.724,-8.87) 19(-0.774,-10.82) 20(0.724,-10.17)
  oval 1.199x2.401 hole 1x2: 21(2.505,2.561) 22(2.505,-8.992) 23(-2.555,-11.089) 24(-2.555,0.709)
FAN2510
  round 3.5 hole 3x2.7: 1(28.321,17.053) 2(-2.54,-3.14)
FBGA-153_L13.0-W11.5
  oval 0.2x0.305 smd: A1(-3.25,3.25) A2(-2.75,3.25) A3(-2.25,3.25) A4(-1.75,3.25) A5(-1.25,3.25) A6(-0.75,3.25) A7(-0.25,3.25) A8(0.25,3.25) A9(0.75,3.25) A10(1.25,3.25) A11(1.75,3.25) A12(2.25,3.25) A13(2.75,3.25) A14(3.25,3.25) P1(-3.25,-3.25) P2(-2.75,-3.25) P3(-2.25,-3.25) P4(-1.75,-3.25) P5(-1.25,-3.25) P6(-0.75,-3.25) P7(-0.25,-3.25) P8(0.25,-3.25) P9(0.75,-3.25) P10(1.25,-3.25) P11(1.75,-3.25) P12(2.25,-3.25) P13(2.75,-3.25) P14(3.25,-3.25)
  oval 0.305x0.2 smd: B1(-3.25,2.75) B14(3.25,2.75) C1(-3.25,2.25) C14(3.25,2.25) D1(-3.25,1.75) D14(3.25,1.75) E1(-3.25,1.25) E14(3.25,1.25) F1(-3.25,0.75) F14(3.25,0.75) G1(-3.25,0.25) G14(3.25,0.25) H1(-3.25,-0.25) H14(3.25,-0.25) J1(-3.25,-0.75) J14(3.25,-0.75) K1(-3.25,-1.25) K14(3.25,-1.25) L1(-3.25,-1.75) L14(3.25,-1.75) M1(-3.25,-2.25) M14(3.25,-2.25) N1(-3.25,-2.75) N14(3.25,-2.75)
  round 0.25 smd: B2(-2.75,2.75) B3(-2.25,2.75) B4(-1.75,2.75) B5(-1.25,2.75) B6(-0.75,2.75) B7(-0.25,2.75) B8(0.25,2.75) B9(0.75,2.75) B10(1.25,2.75) B11(1.75,2.75) B12(2.25,2.75) B13(2.75,2.75) C2(-2.75,2.25) C3(-2.25,2.25) C4(-1.75,2.25) C5(-1.25,2.25) C6(-0.75,2.25) C7(-0.25,2.25) C8(0.25,2.25) C9(0.75,2.25) C10(1.25,2.25) C11(1.75,2.25) C12(2.25,2.25) C13(2.75,2.25) D2(-2.75,1.75) D3(-2.25,1.75) D4(-1.75,1.75) D12(2.25,1.75) D13(2.75,1.75) E2(-2.75,1.25) E3(-2.25,1.25) E5(-1.25,1.25) E6(-0.75,1.25) E7(-0.25,1.25) E8(0.25,1.25) E9(0.75,1.25) E10(1.25,1.25) E12(2.25,1.25) E13(2.75,1.25) F2(-2.75,0.75) F3(-2.25,0.75) F5(-1.25,0.75) F10(1.25,0.75) F12(2.25,0.75) F13(2.75,0.75) G2(-2.75,0.25) G3(-2.25,0.25) G5(-1.25,0.25) G10(1.25,0.25) G12(2.25,0.25) G13(2.75,0.25) H2(-2.75,-0.25) H3(-2.25,-0.25) H5(-1.25,-0.25) H10(1.25,-0.25) H12(2.25,-0.25) H13(2.75,-0.25) J2(-2.75,-0.75) J3(-2.25,-0.75) J5(-1.25,-0.75) J10(1.25,-0.75) J12(2.25,-0.75) J13(2.75,-0.75) K2(-2.75,-1.25) K3(-2.25,-1.25) K5(-1.25,-1.25) K6(-0.75,-1.25) K7(-0.25,-1.25) K8(0.25,-1.25) K9(0.75,-1.25) K10(1.25,-1.25) K12(2.25,-1.25) K13(2.75,-1.25) L2(-2.75,-1.75) L3(-2.25,-1.75) L12(2.25,-1.75) L13(2.75,-1.75) M2(-2.75,-2.25) M3(-2.25,-2.25) M4(-1.75,-2.25) M5(-1.25,-2.25) M6(-0.75,-2.25) M7(-0.25,-2.25) M8(0.25,-2.25) M9(0.75,-2.25) M10(1.25,-2.25) M11(1.75,-2.25) M12(2.25,-2.25) M13(2.75,-2.25) N2(-2.75,-2.75) N3(-2.25,-2.75) N4(-1.75,-2.75) N5(-1.25,-2.75) N6(-0.75,-2.75) N7(-0.25,-2.75) N8(0.25,-2.75) N9(0.75,-2.75) N10(1.25,-2.75) N11(1.75,-2.75) N12(2.25,-2.75) N13(2.75,-2.75)
FPC-SMD_30P-P0.50_FPC-05FB-30PH20
  rect 0.3x1.2 smd: 1(7.25,1.625) 2(6.75,1.625) 3(6.25,1.625) 4(5.75,1.625) 5(5.25,1.625) 6(4.75,1.625) 7(4.25,1.625) 8(3.75,1.625) 9(3.25,1.625) 10(2.75,1.625) 11(2.25,1.625) 12(1.75,1.625) 13(1.25,1.625) 14(0.75,1.625) 15(0.25,1.625) 16(-0.25,1.625) 17(-0.75,1.625) 18(-1.25,1.625) 19(-1.75,1.625) 20(-2.25,1.625) 21(-2.75,1.625) 22(-3.25,1.625) 23(-3.75,1.625) 24(-4.25,1.625) 25(-4.75,1.625) 26(-5.25,1.625) 27(-5.75,1.625) 28(-6.25,1.625) 29(-6.75,1.625) 30(-7.25,1.625)
  rect 2x1.8 smd: 31(-8.8,-1.625) 32(8.8,-1.625)
FPC-SMD_50P-P0.50_FPC-05FB-50PH20
  rect 0.3x1.2 smd: 1(12.25,1.625) 2(11.75,1.625) 3(11.25,1.625) 4(10.75,1.625) 5(10.25,1.625) 6(9.75,1.625) 7(9.25,1.625) 8(8.75,1.625) 9(8.25,1.625) 10(7.75,1.625) 11(7.25,1.625) 12(6.75,1.625) 13(6.25,1.625) 14(5.75,1.625) 15(5.25,1.625) 16(4.75,1.625) 17(4.25,1.625) 18(3.75,1.625) 19(3.25,1.625) 20(2.75,1.625) 21(2.25,1.625) 22(1.75,1.625) 23(1.25,1.625) 24(0.75,1.625) 25(0.25,1.625) 26(-0.25,1.625) 27(-0.75,1.625) 28(-1.25,1.625) 29(-1.75,1.625) 30(-2.25,1.625) 31(-2.75,1.625) 32(-3.25,1.625) 33(-3.75,1.625) 34(-4.25,1.625) 35(-4.75,1.625) 36(-5.25,1.625) 37(-5.75,1.625) 38(-6.25,1.625) 39(-6.75,1.625) 40(-7.25,1.625) 41(-7.75,1.625) 42(-8.25,1.625) 43(-8.75,1.625) 44(-9.25,1.625) 45(-9.75,1.625) 46(-10.25,1.625) 47(-10.75,1.625) 48(-11.25,1.625) 49(-11.75,1.625) 50(-12.25,1.625)
  rect 2x1.8 smd: 51(-13.8,-1.625) 52(13.8,-1.625)
HDMI-SMD_HDMI-001C
  round 0.8 hole 0.55: 1(5.3,0.5) 2(4.731,-0.5) 3(4.145,0.5) 4(3.575,-0.5) 5(2.99,0.5) 6(2.419,-0.5) 7(1.835,0.5) 8(1.264,-0.5) 9(0.68,0.5) 10(0.107,-0.5) 11(-0.475,0.5) 12(-1.049,-0.5) 13(-1.63,0.5) 14(-2.205,-0.5) 15(-2.785,0.5) 16(-3.361,-0.5) 17(-3.94,0.5) 18(-4.517,-0.5) 19(-5.095,0.5)
  oval 3.2x1.4 hole 2.7x0.9: 20(-6.05,3.25) 20(-2.95,-3.25) 20(3.45,3.25) 20(6.05,-3.25)
HDR-TH_40P-P2.54-V-M-R2-C20-S2.54
  rect 1.575x1.8 hole 1.1: 1(-24.13,-1.27)
  round 1.8 hole 1.1: 2(-24.13,1.27) 3(-21.59,-1.27) 4(-21.59,1.27) 5(-19.05,-1.27) 6(-19.05,1.27) 7(-16.51,-1.27) 8(-16.51,1.27) 9(-13.97,-1.27) 10(-13.97,1.27) 11(-11.43,-1.27) 12(-11.43,1.27) 13(-8.89,-1.27) 14(-8.89,1.27) 15(-6.35,-1.27) 16(-6.35,1.27) 17(-3.81,-1.27) 18(-3.81,1.27) 19(-1.27,-1.27) 20(-1.27,1.27) 21(1.27,-1.27) 22(1.27,1.27) 23(3.81,-1.27) 24(3.81,1.27) 25(6.35,-1.27) 26(6.35,1.27) 27(8.89,-1.27) 28(8.89,1.27) 29(11.43,-1.27) 30(11.43,1.27) 31(13.97,-1.27) 32(13.97,1.27) 33(16.51,-1.27) 34(16.51,1.27) 35(19.05,-1.27) 36(19.05,1.27) 37(21.59,-1.27) 38(21.59,1.27) 39(24.13,-1.27) 40(24.13,1.27)
IND-SMD_L2.0-W1.6
  rect 1x1.72 smd: 1(0.828,0) 2(-0.828,0)
ind-smd_l2.0-w1.6_1
  rect 1.169x1.956 smd: 1(0.889,0) 2(-0.889,0)
IND-SMD_L7.0-W6.6
  rect 2.4x3.2 smd: 1(-3,0) 2(3,0)
IPEX-SMD_BWIPX-1-001E
  rect 1.05x1 smd: 1(-0.762,0)
  rect 2.2x1.05 smd: 2(0.762,-1.475) 3(0.762,1.475)
LED-SMD_4P-L2.0-W2.0-TL_WS2812B-2020
  rect 0.9x0.7 smd: 1(-0.915,0.55) 2(-0.915,-0.55) 3(0.915,-0.55) 4(0.915,0.55)
LGA-44_L12.0-W12.0-P0.90
  rect 1.177x0.6 smd: 1(-5.843,4.5) 2(-5.843,3.6) 3(-5.843,2.7) 4(-5.843,1.8) 5(-5.843,0.9) 6(-5.843,0) 7(-5.843,-0.9) 8(-5.843,-1.8) 9(-5.843,-2.7) 10(-5.843,-3.6) 11(-5.843,-4.5) 23(5.843,-4.5) 24(5.843,-3.6) 25(5.843,-2.7) 26(5.843,-1.8) 27(5.843,-0.9) 28(5.843,0) 29(5.843,0.9) 30(5.843,1.8) 31(5.843,2.7) 32(5.843,3.6) 33(5.843,4.5)
  rect 0.6x1.177 smd: 12(-4.5,-5.843) 13(-3.6,-5.843) 14(-2.7,-5.843) 15(-1.8,-5.843) 16(-0.9,-5.843) 17(0,-5.843) 18(0.9,-5.843) 19(1.8,-5.843) 20(2.7,-5.843) 21(3.6,-5.843) 22(4.5,-5.843) 34(4.5,5.843) 35(3.6,5.843) 36(2.7,5.843) 37(1.8,5.843) 38(0.9,5.843) 39(0,5.843) 40(-0.9,5.843) 41(-1.8,5.843) 42(-2.7,5.843) 43(-3.6,5.843) 44(-4.5,5.843)
osc-smd_l3.2-w1.5 nsk
  rect 1.05x1.7 smd: 1(-1.275,0) 2(1.275,0)
Pad_e551
  round 5 hole 3.3: 54(0,0)
Pad_e553
  round 5 hole 3.3: 54(0,0)
Pad_e554
  round 5 hole 3.3: 54(0,0)
Pad_e555
  round 5 hole 3.3: 54(0,0)
Pad_e563
  round 5 hole 3.3: 54(0,0)
QFN-20_L3.0-W3.0-P0.40-BL-EP1.5
  rect 0.2x0.665 smd: 1(-0.8,-1.407) 2(-0.4,-1.407) 3(0,-1.407) 4(0.4,-1.407) 5(0.8,-1.407) 11(0.8,1.407) 12(0.4,1.407) 13(0,1.407) 14(-0.4,1.407) 15(-0.8,1.407)
  rect 0.665x0.2 smd: 6(1.407,-0.8) 7(1.407,-0.4) 8(1.407,0) 9(1.407,0.4) 10(1.407,0.8) 16(-1.407,0.8) 17(-1.407,0.4) 18(-1.407,0) 19(-1.407,-0.4) 20(-1.407,-0.8)
  rect 1.5x1.5 smd: 21(0,0)
QFN-52_L6.0-W6.0-P0.40-BL-EP3.4-1
  custom 0.2x0.585 smd: 1(-2.4,-2.917) 13(2.4,-2.917) 27(2.4,2.917) 39(-2.4,2.917)
  rect 0.2x0.585 smd: 2(-2,-2.917) 3(-1.6,-2.917) 4(-1.2,-2.917) 5(-0.8,-2.917) 6(-0.4,-2.917) 7(0,-2.917) 8(0.4,-2.917) 9(0.8,-2.917) 10(1.2,-2.917) 11(1.6,-2.917) 12(2,-2.917) 28(2,2.917) 29(1.6,2.917) 30(1.2,2.917) 31(0.8,2.917) 32(0.4,2.917) 33(0,2.917) 34(-0.4,2.917) 35(-0.8,2.917) 36(-1.2,2.917) 37(-1.6,2.917) 38(-2,2.917)
  custom 0.585x0.2 smd: 14(2.917,-2.4) 26(2.917,2.4) 40(-2.917,2.4) 52(-2.917,-2.4)
  rect 0.585x0.2 smd: 15(2.917,-2) 16(2.917,-1.6) 17(2.917,-1.2) 18(2.917,-0.8) 19(2.917,-0.4) 20(2.917,0) 21(2.917,0.4) 22(2.917,0.8) 23(2.917,1.2) 24(2.917,1.6) 25(2.917,2) 41(-2.917,2) 42(-2.917,1.6) 43(-2.917,1.2) 44(-2.917,0.8) 45(-2.917,0.4) 46(-2.917,0) 47(-2.917,-0.4) 48(-2.917,-0.8) 49(-2.917,-1.2) 50(-2.917,-1.6) 51(-2.917,-2)
  rect 3.4x3.4 smd: 53(0,0)
r0201 nsk
  rect 0.303x0.324 smd: 1(-0.241,0) 2(0.241,0)
R0402-NSK
  rect 0.5x0.559 smd: 1(-0.457,0) 2(0.458,0)
R0603 NSK
  rect 0.806x0.864 smd: 1(-0.753,0) 2(0.753,0)
RGBLED_0807
  rect 0.91x1.778 smd: 1(-0.914,0) 2(0.94,0)
RJ45-TH_HR911130A
  round 1.7 hole 1.1: 11(6.604,6.924) 12(4.064,6.924) 13(-4.064,6.924) 14(-6.604,6.924)
  rect 1.524x1.524 hole 0.909: P1(5.832,-6.924)
  round 1.524 hole 0.909: P2(4.549,-4.379) P3(3.18,-6.919) P4(2.009,-4.379) P5(0.64,-6.919) P6(-0.531,-4.379) P7(-1.9,-6.919) P8(-3.071,-4.379) P9(-4.44,-6.919) P10(-5.611,-4.379)
  round 2.159 hole 1.651: SHIELD0(-8.001,-1.079) SHIELD1(8.001,-1.079)
SENSOR-SMD_IRM-H638T-TR2-TL
  rect 1.5x0.9 smd: 1(-2.95,1.27) 2(-2.95,-1.27) 3(2.95,-1.27) 4(2.921,1.27)
SIM-SMD_8P-1040310811
  rect 0.7x1.2 smd: 1(3.138,-5.338) 2(2.038,-5.338) 3(0.938,-5.338) 4(-0.163,-5.338) 5(-1.262,-5.338) 6(-2.362,-5.338) 7(-3.462,-5.338) 8(-4.562,-5.338)
  rect 1.17x1.8 smd: 9(-5.772,-5.138)
  rect 1.55x1.35 smd: 10(5.598,-5.312)
  rect 1.2x1 smd: 11(5.772,0.662) 12(5.772,4.362)
  rect 1.9x1.35 smd: 13(2.272,5.338) 14(-3.697,5.338)
SLP2510P8_L2.5-W1.0-P0.50-BL
  rect 0.2x0.68 smd: 1(-1,-0.44) 2(-0.5,-0.44) 4(0.5,-0.44) 5(1,-0.44) 6(1,0.44) 7(0.5,0.44) 9(-0.5,0.44) 10(-1,0.44)
  rect 0.4x0.68 smd: 3(0.001,-0.44) 8(0.001,0.44)
SMA_L4.4-W2.8-LS5.4-R-RD
  rect 2.062x1.539 smd: 1(2.503,0) 2(-2.503,0)
SMC_L6.9-W5.9-LS7.9-BI
  rect 3.03x3.82 smd: 1(-3.435,0) 2(3.435,0)
SOD-323_L1.8-W1.3-LS2.5-RD
  rect 1x0.75 smd: 1(-1.173,0) 2(1.173,0)
SOD-523_L1.2-W0.8-LS1.6-RD-1 NSK
  rect 0.6x0.36 smd: 1(-0.635,0) 2(0.635,0)
SOIC-8_L5.0-W4.0-P1.27-LS6.0-BL-EP2.0
  oval 0.574x2.038 smd: 1(-1.905,-2.769) 2(-0.635,-2.769) 3(0.635,-2.769) 4(1.905,-2.769) 5(1.905,2.769) 6(0.635,2.769) 7(-0.635,2.769) 8(-1.905,2.769)
  rect 2x2 smd: 9(0,0)
SOP-8_L4.9-W3.9-P1.27-LS6.0-BL
  oval 0.63x1.865 smd: 1(-1.905,-2.683) 2(-0.635,-2.683) 3(0.635,-2.683) 4(1.905,-2.683) 5(1.905,2.683) 6(0.635,2.683) 7(-0.635,2.683) 8(-1.905,2.683)
SOT-23-3_L2.9-W1.3-P1.90-LS2.4-BR
  rect 1.25x0.7 smd: 1(1,-0.95) 2(1,0.95) 3(-1,0)
SOT-23-5_L3.0-W1.7-P0.95-LS2.8-BL
  rect 0.49x1.157 smd: 1(-0.95,-1.153) 2(0,-1.153) 3(0.95,-1.153)
  rect 0.49x1.175 smd: 4(0.95,1.153) 5(-0.95,1.153)
SW-SMD_4P-L4.2-W3.4-P2.15-LS4.5-TL
  rect 1.05x0.7 smd: 1(-2.1,1.075) 2(2.1,1.075) 3(-2.1,-1.075) 4(2.1,-1.075)
T527-BGA664
  round 0.229 smd: A1(-8,8) A2(-7.5,8) A3(-7,8) A4(-6.5,8) A5(-6,8) A6(-5.5,8) A8(-4.5,8) A10(-3.5,8) A12(-2.5,8) A14(-1.5,8) A16(-0.5,8) A18(0.5,8) A20(1.5,8) A22(2.5,8) A24(3.5,8) A26(4.5,8) A28(5.5,8) A29(6,8) A30(6.5,8) A31(7,8) A32(7.5,8) A33(8,8) AA1(-8,-2) AA2(-7.5,-2) AA3(-7,-2) AA4(-6.5,-2) AA5(-6,-2) AA6(-5.5,-2) AA7(-5,-2) AA9(-4,-2) AA12(-2.5,-2) AA13(-2,-2) AA15(-1,-2) AA16(-0.5,-2) AA18(0.5,-2) AA19(1,-2) AA21(2,-2) AA22(2.5,-2) AA24(3.5,-2) AA26(4.5,-2) AA27(5,-2) AA28(5.5,-2) AA29(6,-2) AA30(6.5,-2) AA31(7,-2) AA32(7.5,-2) AA33(8,-2) AB2(-7.5,-2.501) AB3(-7,-2.5) AB9(-4,-2.501) AB10(-3.5,-2.5) AB11(-3,-2.5) AB12(-2.5,-2.5) AB13(-2,-2.5) AB14(-1.5,-2.5) AB15(-1,-2.5) AB17(0,-2.5) AB24(3.5,-2.5) AB32(7.5,-2.501) AB33(8,-2.5) AC1(-8,-3) AC2(-7.5,-3) AC3(-7,-3) AC4(-6.5,-3) AC5(-6,-3) AC6(-5.5,-3) AC7(-5,-3) AC9(-4,-3) AC15(-1,-3) AC17(0,-3) AC18(0.5,-3) AC19(1,-3) AC20(1.5,-3) AC22(2.5,-3) AC24(3.5,-3) AC26(4.5,-3) AC27(5,-3) AC28(5.5,-3) AC29(6,-3) AC30(6.5,-3) AC31(7,-3) AC32(7.5,-3) AC33(8,-3) AD1(-8,-3.5) AD2(-7.5,-3.5) AD9(-4,-3.5) AD11(-3,-3.5) AD13(-2,-3.5) AD14(-1.5,-3.5) AD15(-1,-3.5) AD20(1.5,-3.5) AD21(2,-3.5) AD22(2.5,-3.5) AD25(4,-3.5) AD32(7.5,-3.5) AD33(8,-3.5) AE1(-8,-4) AE2(-7.5,-4) AE3(-7,-4) AE4(-6.5,-4) AE5(-6,-4) AE6(-5.5,-4) AE7(-5,-4) AE9(-4,-4) AE11(-3,-4) AE12(-2.501,-4) AE13(-2,-4) AE14(-1.5,-4) AE16(-0.5,-4) AE18(0.5,-4) AE19(1,-4) AE20(1.5,-4) AE21(2,-4) AE22(2.501,-4) AE23(3,-4) AE24(3.5,-4) AE25(4,-4) AE26(4.5,-4) AE27(5,-4) AE28(5.5,-4) AE29(6,-4) AE30(6.5,-4) AE31(7,-4) AE32(7.5,-4) AE33(8,-4) AF1(-8,-4.5) AF2(-7.5,-4.5) AF32(7.5,-4.5) AF33(8,-4.5) AG1(-8,-5) AG2(-7.5,-5) AG3(-7,-5) AG4(-6.5,-5) AG5(-6,-5) AG6(-5.5,-5) AG7(-5,-5) AG9(-4,-5) AG11(-3,-5) AG13(-2,-5) AG15(-1,-5) AG17(0,-5) AG19(1,-5) AG21(2,-5) AG23(3,-5) AG25(4,-5) AG28(5.5,-5) AG29(6,-5) AG30(6.5,-5) AG31(7,-5) AG32(7.5,-5) AG33(8,-5) AH1(-8,-5.5) AH2(-7.5,-5.5) AH7(-5,-5.5) AH9(-4,-5.5) AH11(-3,-5.5) AH13(-2,-5.5) AH15(-1,-5.5) AH17(0,-5.5) AH19(1,-5.5) AH21(2,-5.5) AH23(3,-5.5) AH25(4,-5.5) AH27(5,-5.5) AH32(7.5,-5.5) AH33(8,-5.5) AJ1(-8,-6) AJ2(-7.5,-6) AJ3(-7,-6) AJ4(-6.5,-6) AJ5(-6,-6) AJ7(-5,-6) AJ9(-4,-6) AJ11(-3,-6) AJ13(-2,-6) AJ15(-1,-6) AJ17(0,-6) AJ19(1,-6) AJ21(2,-6) AJ23(3,-6) AJ25(4,-6) AJ27(5,-6) AJ30(6.5,-6) AJ31(7,-6) AJ32(7.5,-6) AJ33(8,-6) AK1(-8,-6.5) AK2(-7.5,-6.5) AK5(-6,-6.5) AK7(-5,-6.5) AK9(-4,-6.5) AK11(-3,-6.5) AK13(-2,-6.5) AK15(-1,-6.5) AK17(0,-6.5) AK19(1,-6.5) AK21(2,-6.5) AK23(3,-6.5) AK25(4,-6.5) AK27(5,-6.5) AK29(6,-6.5) AK32(7.5,-6.5) AK33(8,-6.5) AL1(-8,-7) AL2(-7.5,-7) AL3(-7,-7) AL5(-6,-7) AL7(-5,-7) AL9(-4,-7) AL11(-3,-7) AL12(-2.5,-7) AL13(-2,-7) AL14(-1.5,-7) AL15(-1,-7) AL16(-0.5,-7) AL17(0,-7) AL19(1,-7) AL21(2,-7) AL23(3,-7) AL25(4,-7) AL27(5,-7) AL29(6,-7) AL31(7,-7) AL32(7.5,-7) AL33(8,-7) AM1(-8,-7.5) AM2(-7.5,-7.5) AM3(-7,-7.5) AM4(-6.5,-7.5) AM5(-6,-7.5) AM6(-5.5,-7.5) AM7(-5,-7.5) AM8(-4.5,-7.5) AM9(-4,-7.5) AM10(-3.5,-7.5) AM11(-3,-7.5) AM12(-2.501,-7.5) AM13(-2,-7.5) AM14(-1.5,-7.5) AM15(-1,-7.5) AM16(-0.5,-7.5) AM17(0,-7.5) AM18(0.5,-7.5) AM19(1,-7.5) AM20(1.5,-7.5) AM21(2,-7.5) AM22(2.501,-7.5) AM23(3,-7.5) AM24(3.5,-7.5) AM25(4,-7.5) AM26(4.5,-7.5) AM27(5,-7.5) AM28(5.5,-7.5) AM29(6,-7.5) AM30(6.5,-7.5) AM31(7,-7.5) AM32(7.5,-7.5) AM33(8,-7.5) AN1(-8,-8) AN2(-7.5,-8) AN3(-7,-8) AN4(-6.5,-8) AN5(-6,-8) AN6(-5.5,-8) AN7(-5,-8) AN8(-4.5,-8) AN9(-4,-8) AN10(-3.5,-8) AN11(-3,-8) AN13(-2,-8) AN15(-1,-8) AN17(0,-8) AN18(0.5,-8) AN19(1,-8) AN20(1.5,-8) AN21(2,-8) AN22(2.5,-8) AN23(3,-8) AN24(3.5,-8) AN25(4,-8) AN26(4.5,-8) AN27(5,-8) AN28(5.5,-8) AN29(6,-8) AN30(6.5,-8) AN31(7,-8) AN32(7.5,-8) AN33(8,-8) B1(-8,7.5) B2(-7.5,7.5) B3(-7,7.5) B4(-6.5,7.5) B5(-6,7.5) B6(-5.5,7.5) B7(-5,7.5) B8(-4.5,7.5) B9(-4,7.5) B10(-3.5,7.5) B11(-3,7.5) B12(-2.501,7.5) B13(-2,7.5) B14(-1.5,7.5) B15(-1,7.5) B16(-0.5,7.5) B17(0,7.5) B18(0.5,7.5) B19(1,7.5) B20(1.5,7.5) B21(2,7.5) B22(2.501,7.5) B23(3,7.5) B24(3.5,7.5) B25(4,7.5) B26(4.5,7.5) B27(5,7.5) B28(5.5,7.5) B29(6,7.5) B30(6.5,7.5) B31(7,7.5) B32(7.5,7.5) B33(8,7.5) C1(-8,7) C2(-7.5,7) C3(-7,7) C4(-6.5,7) C6(-5.5,7) C7(-5,7) C8(-4.5,7) C9(-4,7) C10(-3.5,7) C11(-3,7) C12(-2.5,7) C13(-2,7) C14(-1.5,7) C15(-1,7) C16(-0.5,7) C17(0,7) C18(0.5,7) C19(1,7) C20(1.5,7) C21(2,7) C22(2.5,7) C23(3,7) C24(3.5,7) C25(4,7) C26(4.5,7) C27(5,7) C28(5.5,7) C29(6,7) C30(6.5,7) C31(7,7) C32(7.5,7) C33(8,7) D1(-8,6.5) D2(-7.5,6.5) D6(-5.5,6.5) D8(-4.5,6.5) D10(-3.5,6.5) D12(-2.5,6.5) D14(-1.5,6.5) D16(-0.5,6.5) D18(0.5,6.5) D20(1.5,6.5) D22(2.5,6.5) D24(3.5,6.5) D26(4.5,6.5) D28(5.5,6.5) D32(7.5,6.5) D33(8,6.5) E1(-8,6) E2(-7.5,6) E3(-7,6) E4(-6.5,6) E5(-6,6) E6(-5.5,6) E8(-4.5,6) E10(-3.5,6) E12(-2.5,6) E14(-1.5,6) E16(-0.5,6) E18(0.5,6) E20(1.5,6) E22(2.5,6) E24(3.5,6) E26(4.5,6) E28(5.5,6) E29(6,6) E30(6.5,6) E31(7,6) E32(7.5,6) E33(8,6) F1(-8,5.5) F2(-7.5,5.5) F6(-5.5,5.5) F8(-4.5,5.5) F10(-3.5,5.5) F12(-2.5,5.5) F14(-1.5,5.5) F16(-0.5,5.5) F18(0.5,5.5) F20(1.5,5.5) F22(2.5,5.5) F24(3.5,5.5) F26(4.5,5.5) F28(5.5,5.5) F32(7.5,5.5) F33(8,5.5) G1(-8,5) G2(-7.5,5) G3(-7,5) G4(-6.5,5) G5(-6,5) G6(-5.5,5) G8(-4.5,5) G10(-3.5,5) G12(-2.5,5) G14(-1.5,5) G16(-0.5,5) G18(0.5,5) G20(1.5,5) G22(2.5,5) G24(3.5,5) G26(4.5,5) G28(5.5,5) G29(6,5) G30(6.5,5) G31(7,5) G32(7.5,5) G33(8,5) H2(-7.5,4.5) H3(-7,4.5) H24(3.5,4.5) H31(7,4.5) H32(7.5,4.5) J1(-8,4) J2(-7.5,4) J3(-7,4) J4(-6.5,4) J5(-6,4) J6(-5.5,4) J7(-5,4) J9(-4,4) J10(-3.5,4) J12(-2.501,4) J13(-2,4) J15(-1,4) J16(-0.5,4) J17(0,4) J18(0.5,4) J19(1,4) J21(2,4) J22(2.501,4) J23(3,4) J26(4.5,4) J28(5.5,4) J29(6,4) J30(6.5,4) J31(7,4) J32(7.5,4) J33(8,4) K2(-7.5,3.5) K3(-7,3.5) K9(-4,3.5) K10(-3.5,3.5) K11(-3,3.5) K12(-2.5,3.5) K13(-2,3.5) K15(-1,3.5) K16(-0.5,3.5) K19(1,3.5) K21(2,3.5) K22(2.5,3.5) K24(3.5,3.5) K25(4,3.5) K26(4.5,3.5) K31(7,3.5) K32(7.5,3.5) L1(-8,3) L2(-7.5,3) L3(-7,3) L4(-6.5,3) L5(-6,3) L6(-5.5,3) L7(-5,3) L9(-4,3) L10(-3.5,3) L12(-2.5,3) L13(-2,3) L15(-1,3) L16(-0.5,3) L17(0,3) L18(0.5,3) L19(1,3) L21(2,3) L22(2.5,3) L24(3.5,3) L26(4.5,3) L27(5,3) L28(5.5,3) L29(6,3) L30(6.5,3) L31(7,3) L32(7.5,3) L33(8,3) M2(-7.5,2.501) M3(-7,2.5) M10(-3.5,2.5) M13(-2,2.5) M16(-0.5,2.5) M18(0.5,2.5) M19(1,2.5) M21(2,2.5) M22(2.5,2.5) M31(7,2.5) M32(7.5,2.501) N1(-8,2) N2(-7.5,2) N3(-7,2) N4(-6.5,2) N5(-6,2) N6(-5.5,2) N7(-5,2) N9(-4,2) N10(-3.5,2) N12(-2.5,2) N13(-2,2) N15(-1,2) N18(0.5,2) N19(1,2) N21(2,2) N22(2.5,2) N24(3.5,2) N26(4.5,2) N27(5,2) N28(5.5,2) N29(6,2) N30(6.5,2) N31(7,2) N32(7.5,2) N33(8,2) P2(-7.5,1.5) P3(-7,1.5) P9(-4,1.5) P11(-3,1.5) P13(-2,1.5) P16(-0.5,1.5) P18(0.5,1.5) P19(1,1.5) P21(2,1.5) P22(2.5,1.5) P24(3.5,1.5) P31(7,1.5) P32(7.5,1.5) R1(-8,1) R2(-7.5,1) R3(-7,1) R4(-6.5,1) R5(-6,1) R6(-5.5,1) R7(-5,1) R11(-3,1) R13(-2,1) R15(-1,1) R17(0,1) R18(0.5,1) R19(1,1) R22(2.5,1) R24(3.5,1) R26(4.5,1) R27(5,1) R28(5.5,1) R29(6,1) R30(6.5,1) R31(7,1) R32(7.5,1) R33(8,1) T2(-7.5,0.5) T3(-7,0.5) T9(-4,0.5) T11(-3,0.5) T13(-2,0.5) T15(-1,0.5) T16(-0.5,0.5) T18(0.5,0.5) T19(1,0.5) T21(2,0.5) T22(2.5,0.5) T24(3.5,0.5) T31(7,0.5) T32(7.5,0.5) U1(-8,0) U2(-7.5,0) U3(-7,0) U4(-6.5,0) U5(-6,0) U6(-5.5,0) U7(-5,0) U8(-4.5,0) U10(-3.5,0) U12(-2.5,0) U13(-2,0) U14(-1.5,0) U16(-0.5,0) U18(0.5,0) U19(1,0) U21(2,0) U22(2.5,0) U25(4,0) U26(4.5,0) U27(5,0) U28(5.5,0) U29(6,0) U30(6.5,0) U31(7,0) U32(7.5,0) U33(8,0) V2(-7.5,-0.5) V3(-7,-0.5) V18(0.5,-0.5) V19(1,-0.5) V31(7,-0.5) V32(7.5,-0.5) W1(-8,-1) W2(-7.5,-1) W3(-7,-1) W4(-6.5,-1) W5(-6,-1) W6(-5.5,-1) W7(-5,-1) W9(-4,-1) W10(-3.5,-1) W12(-2.5,-1) W13(-2,-1) W15(-1,-1) W16(-0.5,-1) W19(1,-1) W21(2,-1) W22(2.5,-1) W23(3,-1) W24(3.5,-1) W25(4,-1) W27(5,-1) W28(5.5,-1) W29(6,-1) W30(6.5,-1) W31(7,-1) W32(7.5,-1) W33(8,-1) Y2(-7.5,-1.5) Y3(-7,-1.5) Y9(-4,-1.5) Y10(-3.5,-1.5) Y12(-2.5,-1.5) Y13(-2,-1.5) Y15(-1,-1.5) Y18(0.5,-1.5) Y19(1,-1.5) Y21(2,-1.5) Y22(2.5,-1.5) Y23(3,-1.5) Y24(3.5,-1.5) Y26(4.5,-1.5) Y31(7,-1.5) Y32(7.5,-1.5)
TFT_1.14寸_0.7MM-13P
  oval 4x0.35 smd: 1(2.65,4.2) 2(2.65,3.5) 3(2.65,2.8) 4(2.65,2.1) 5(2.65,1.4) 6(2.65,0.7) 7(2.65,0) 8(2.65,-0.7) 9(2.65,-1.4) 10(2.65,-2.1) 11(2.65,-2.8) 12(2.65,-3.5) 13(2.65,-4.2)
USB-A-TH_XUNPU_USB-303WSD-BRY
  round 1.1 hole 0.7: 1(-3.5,-1.35) 2(-1,-1.35) 3(1,-1.35) 4(3.5,-1.35) 5(4,0.15) 6(2,0.15) 7(0,0.15) 8(-2,0.15) 9(-4,0.15) 10(-3.5,1.85) 11(-1,1.85) 12(1,1.85) 13(3.5,1.85) 14(4,3.35) 15(2,3.35) 16(0,3.35) 17(-2,3.35) 18(-4,3.35)
  round 3.2 hole 2.4: 19(6.57,-3.35) 20(6.57,2.33) 21(-6.57,2.33) 22(-6.57,-3.35)
USB-C-SMD_TYPEC-304-BCP16-1
  oval 1x2.1 hole 0.6x1.7: 12(-4.32,1.633) 13(4.32,1.633)
  oval 1x1.6 hole 0.6x1.2: 14(-4.32,-2.547) 15(4.32,-2.547)
  rect 0.55x1.45 smd: A1B12(-3.225,2.547) A4B9(-2.45,2.547) B1A12(3.225,2.547) B4A9(2.45,2.547)
  rect 0.3x1.45 smd: A5(-1.25,2.547) A6(-0.25,2.547) A7(0.25,2.547) A8(1.25,2.547) B5(1.75,2.547) B6(0.75,2.547) B7(-0.75,2.547) B8(-1.75,2.547)
WQFN-40_L5.0-W5.0-P0.4-BL-EP
  oval 0.2x0.8 smd: 1(-1.801,-2.499) 2(-1.399,-2.499) 3(-1.001,-2.499) 4(-0.6,-2.499) 5(-0.201,-2.499) 6(0.201,-2.499) 7(0.6,-2.499) 8(1.001,-2.499) 9(1.399,-2.499) 10(1.801,-2.499) 21(1.801,2.499) 22(1.399,2.499) 23(1.001,2.499) 24(0.6,2.499) 25(0.201,2.499) 26(-0.201,2.499) 27(-0.6,2.499) 28(-1.001,2.499) 29(-1.399,2.499) 30(-1.801,2.499)
  oval 0.8x0.2 smd: 11(2.499,-1.801) 12(2.499,-1.399) 13(2.499,-1.001) 14(2.499,-0.6) 15(2.499,-0.201) 16(2.499,0.201) 17(2.499,0.6) 18(2.499,1.001) 19(2.499,1.399) 20(2.499,1.801) 31(-2.499,1.801) 32(-2.499,1.399) 33(-2.499,1.001) 34(-2.499,0.6) 35(-2.499,0.201) 36(-2.499,-0.201) 37(-2.499,-0.6) 38(-2.499,-1.001) 39(-2.499,-1.399) 40(-2.499,-1.801)
  rect 3.8x3.8 smd: 41(0,0)
WSON-8_L8.0-W6.10-P1.27-BL-EP
  oval 0.56x1.4 smd: 1(-1.905,-4.027) 2(-0.635,-4.027) 3(0.635,-4.027) 4(1.905,-4.027) 5(1.905,4.027) 6(0.635,4.027) 7(-0.635,4.027) 8(-1.905,4.027)
  rect 4.3x3.4 smd: 9(0,0)

## Nets
AGND: C108.1 C109.1 C110.1 C111.1 R28.2 U14.AE3
